# Altium project plc_module_xs.00001.001.PrjPcb
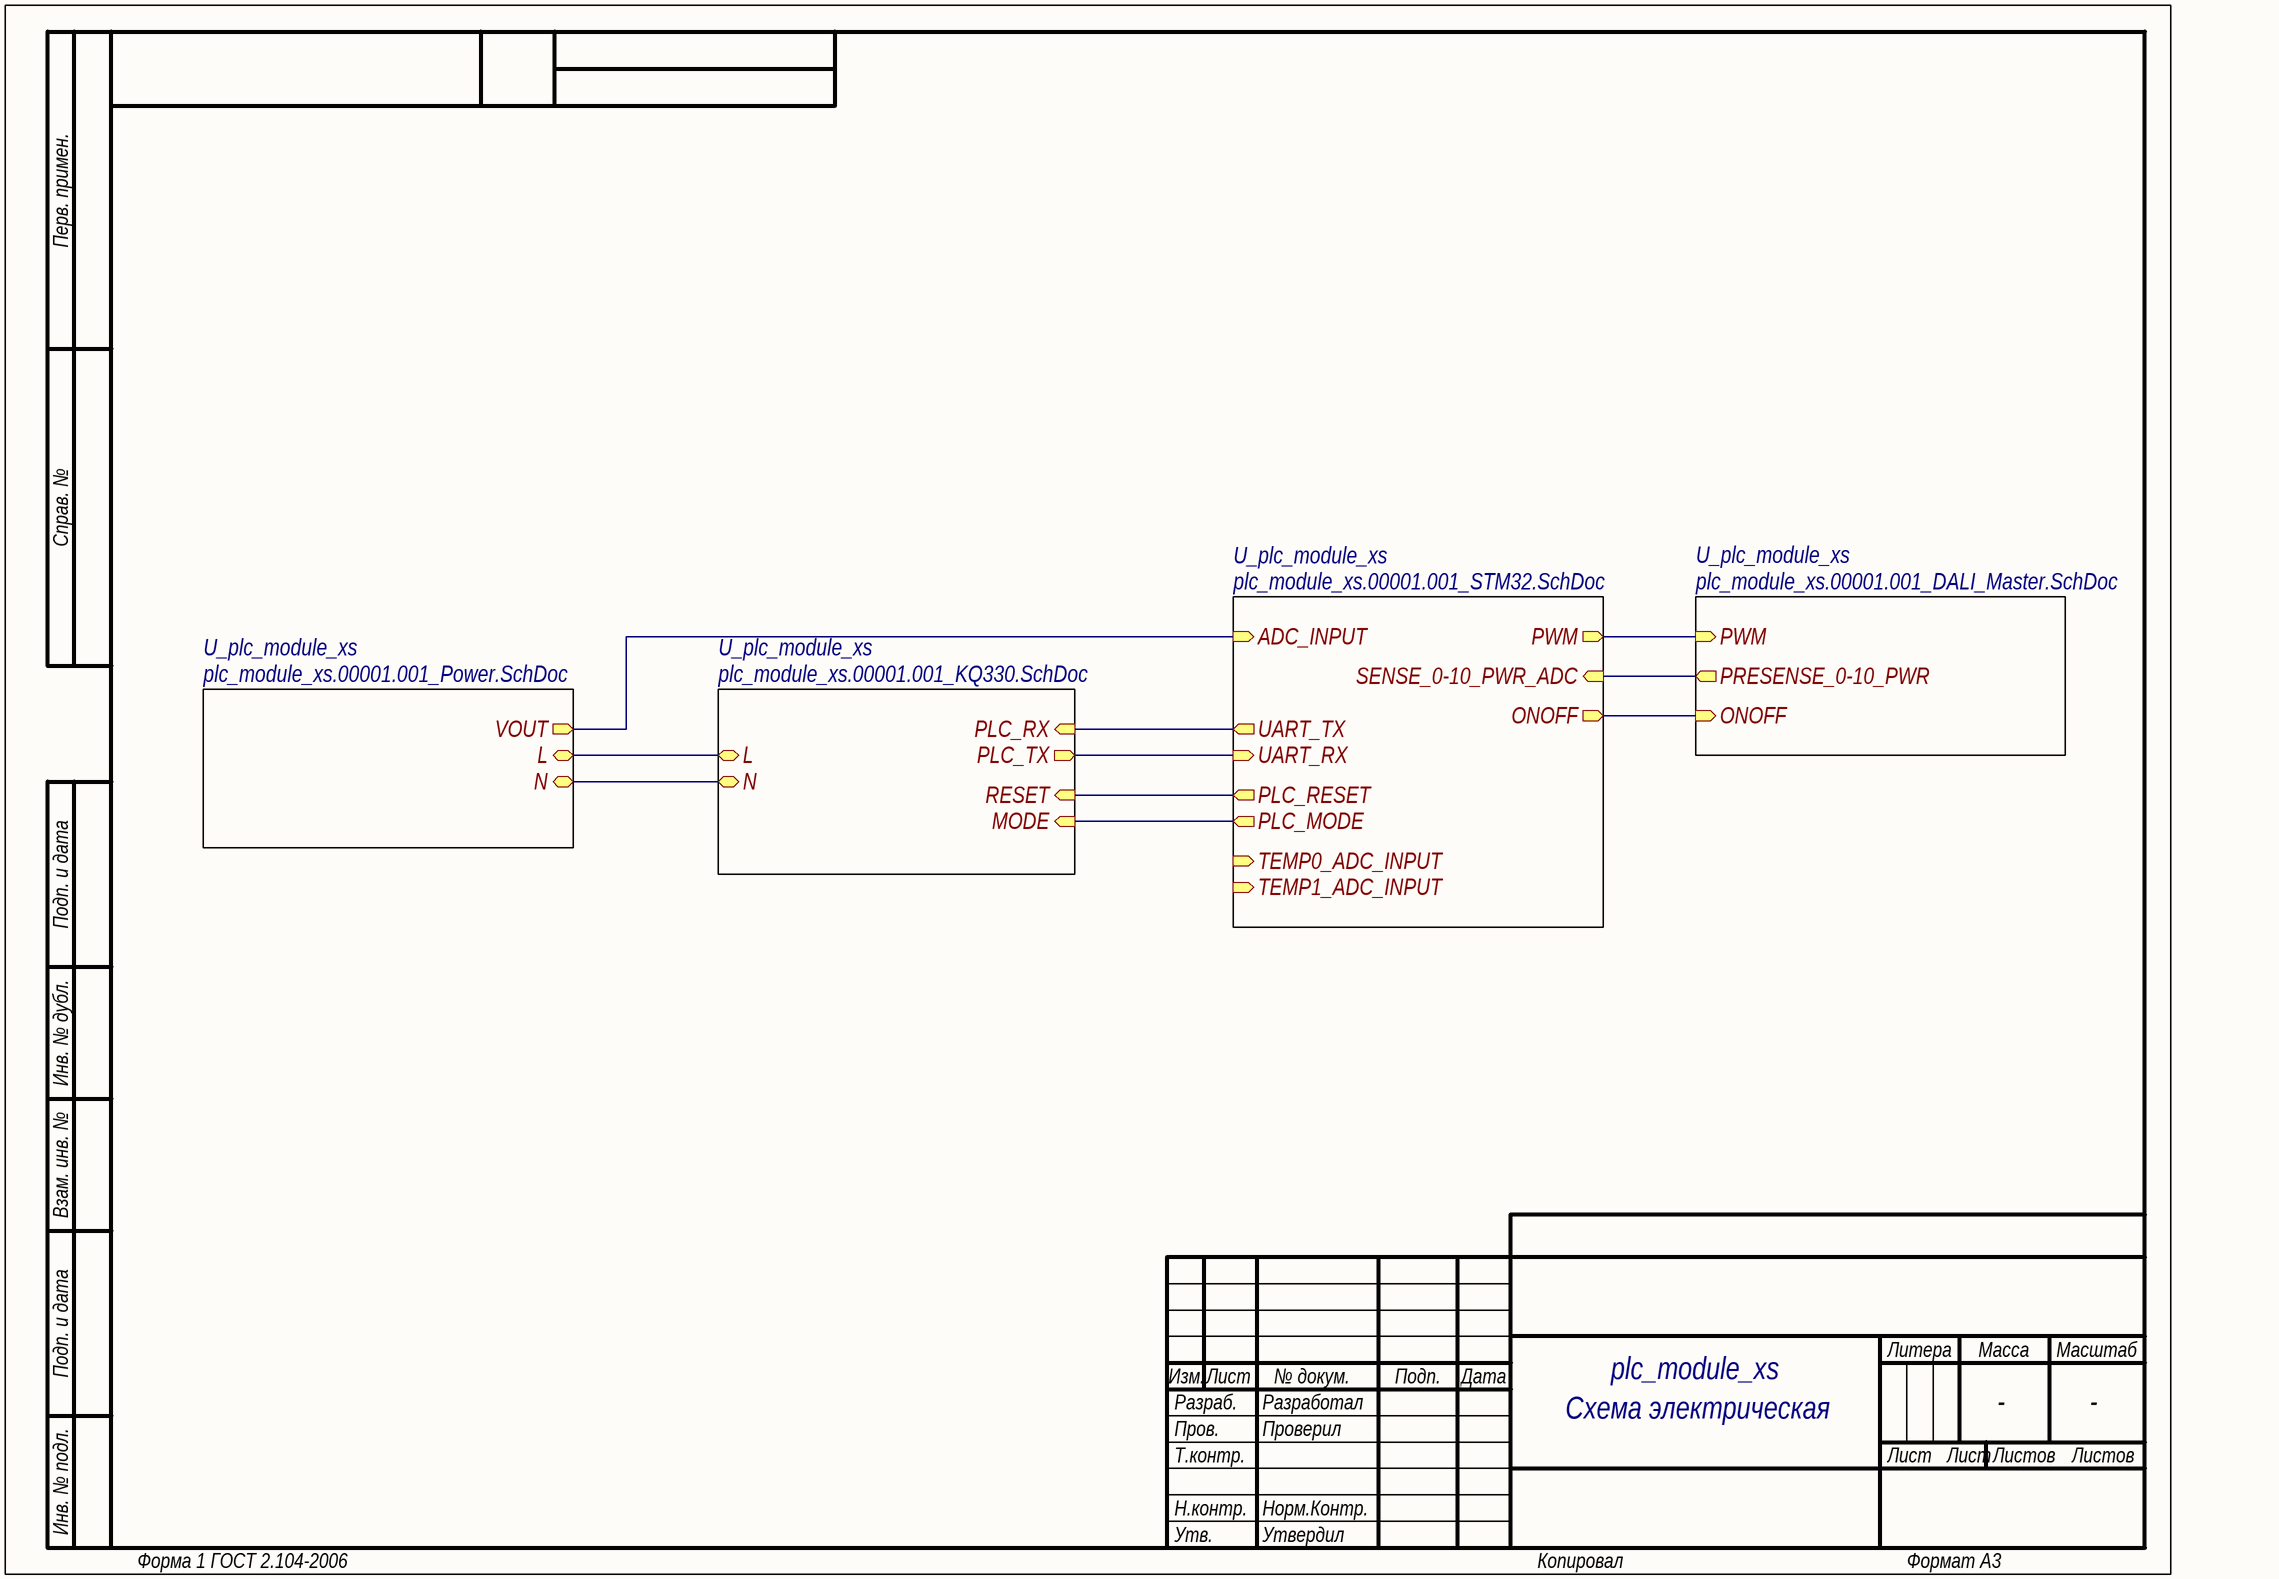
[diagram p0: plc_module_xs.00001.001_Top.SchDoc]
GlobalOrganizationName: TheGreenLight; GlobalProjectName: plc_module_xs; GlobalProjectNumber: 000001.001; GlobalProjectRevision: 1.0
5 sheets, 82 parts. Net scope: hierarchical (ports join the sheet entries above them; power ports are global).
Board file: plc_module_xs.00001.001.PcbDoc
Sheets:
  plc_module_xs.00001.001_Top.SchDoc
    U_plc_module_xs = plc_module_xs.00001.001_STM32.SchDoc
    U_plc_module_xs = plc_module_xs.00001.001_DALI_Master.SchDoc
    U_plc_module_xs = plc_module_xs.00001.001_KQ330.SchDoc
    U_plc_module_xs = plc_module_xs.00001.001_Power.SchDoc

## Sheet plc_module_xs.00001.001_Top.SchDoc: =GlobalProjectName
size 410 x 297 mm; ApprovedBy: Утвердил; CheckedBy: Проверил; Author: Разработал; Organization: TheGreenLight; DocumentNumber: 000001.001 Э3; Revision: 1.0; SheetNumber: Лист; SheetTotal: Листов; PageSetup: Record=PageOptions|CenterHorizontal=True|CenterVertical=True|PrintScale=1.00|XCorrection=1.00|YCorrection=1.00|PrintKind=1|BorderSize=5000000|LeftOffset=0|BottomOffset=0|Orientation=2|PaperLength=1000|PaperWidth=1000|Scale=100|PaperSource=15|PrintQuality=1200|MediaType=1|DitherType=10|PaperKind=A3|PrintScaleMode=1; Weight: -; ScaleFactor: -; NormInspection: Норм.Контр.; FirstApplication: 000001.001; DocumentName: plc_module_xs

### Sub-sheets
U_plc_module_xs = plc_module_xs.00001.001_STM32.SchDoc: UART_TX (out), UART_RX (in), PLC_MODE (out), PLC_RESET (out), PWM (out), ADC_INPUT (in), SENSE_0-10_PWR_ADC (in), TEMP0_ADC_INPUT (in), TEMP1_ADC_INPUT (in), ONOFF (out)
U_plc_module_xs = plc_module_xs.00001.001_DALI_Master.SchDoc: PWM (in), PRESENSE_0-10_PWR (out), ONOFF (in)
U_plc_module_xs = plc_module_xs.00001.001_KQ330.SchDoc: MODE (in), N, RESET (in), L, PLC_RX (in), PLC_TX (out)
U_plc_module_xs = plc_module_xs.00001.001_Power.SchDoc: L, N, VOUT (out)

### Nets
NetC10_2: sheet U_plc_module_xs/L, sheet U_plc_module_xs/L
NetDA1_7: sheet U_plc_module_xs/SENSE_0-10_PWR_ADC, sheet U_plc_module_xs/PRESENSE_0-10_PWR
NetDA2_2: sheet U_plc_module_xs/N, sheet U_plc_module_xs/N
NetDD1_6: sheet U_plc_module_xs/UART_TX, sheet U_plc_module_xs/PLC_RX
NetDD1_9: sheet U_plc_module_xs/UART_RX, sheet U_plc_module_xs/PLC_TX
NetDD1_10: sheet U_plc_module_xs/PLC_MODE, sheet U_plc_module_xs/MODE
NetDD1_11: sheet U_plc_module_xs/PLC_RESET, sheet U_plc_module_xs/RESET
NetDD2_7: sheet U_plc_module_xs/ADC_INPUT, sheet U_plc_module_xs/VOUT
NetDD8_9: sheet U_plc_module_xs/PWM, sheet U_plc_module_xs/PWM
NetDD8_14: sheet U_plc_module_xs/ONOFF, sheet U_plc_module_xs/ONOFF

### Notes on the sheet
- Схема электрическая
  принципиальная
- Перв. примен.
- Справ. №
- Подп. и дата
- Инв. № дубл.
- Взам. инв. №
- Разраб.
- Изм.
- Лист
- № докум.
- Подп.
- Дата
- Литера
- Масса
- Масштаб
- Пров.
- Т.контр.
- Листов
- Инв. № подл.
- Н.контр.
- Утв.
- Форма 1 ГОСТ 2.104-2006
- Копировал
- Формат А3

## Sheet plc_module_xs.00001.001_STM32.SchDoc: =GlobalProjectName
size 410 x 297 mm; ApprovedBy: Утвердил; CheckedBy: Проверил; Author: Разработал; Organization: TheGreenLight; DocumentNumber: 000001.001 Э3; Revision: 1.0; SheetNumber: Лист; SheetTotal: Листов; PageSetup: Record=PageOptions|CenterHorizontal=True|CenterVertical=True|PrintScale=1.00|XCorrection=1.00|YCorrection=1.00|PrintKind=1|BorderSize=5000000|LeftOffset=0|BottomOffset=0|Orientation=2|PaperLength=1000|PaperWidth=1000|Scale=100|PaperSource=15|PrintQuality=1200|MediaType=1|DitherType=10|PaperKind=A3|PrintScaleMode=1; Weight: -; ScaleFactor: -; NormInspection: Норм.Контр.; FirstApplication: 000001.001; DocumentName: plc_module_xs
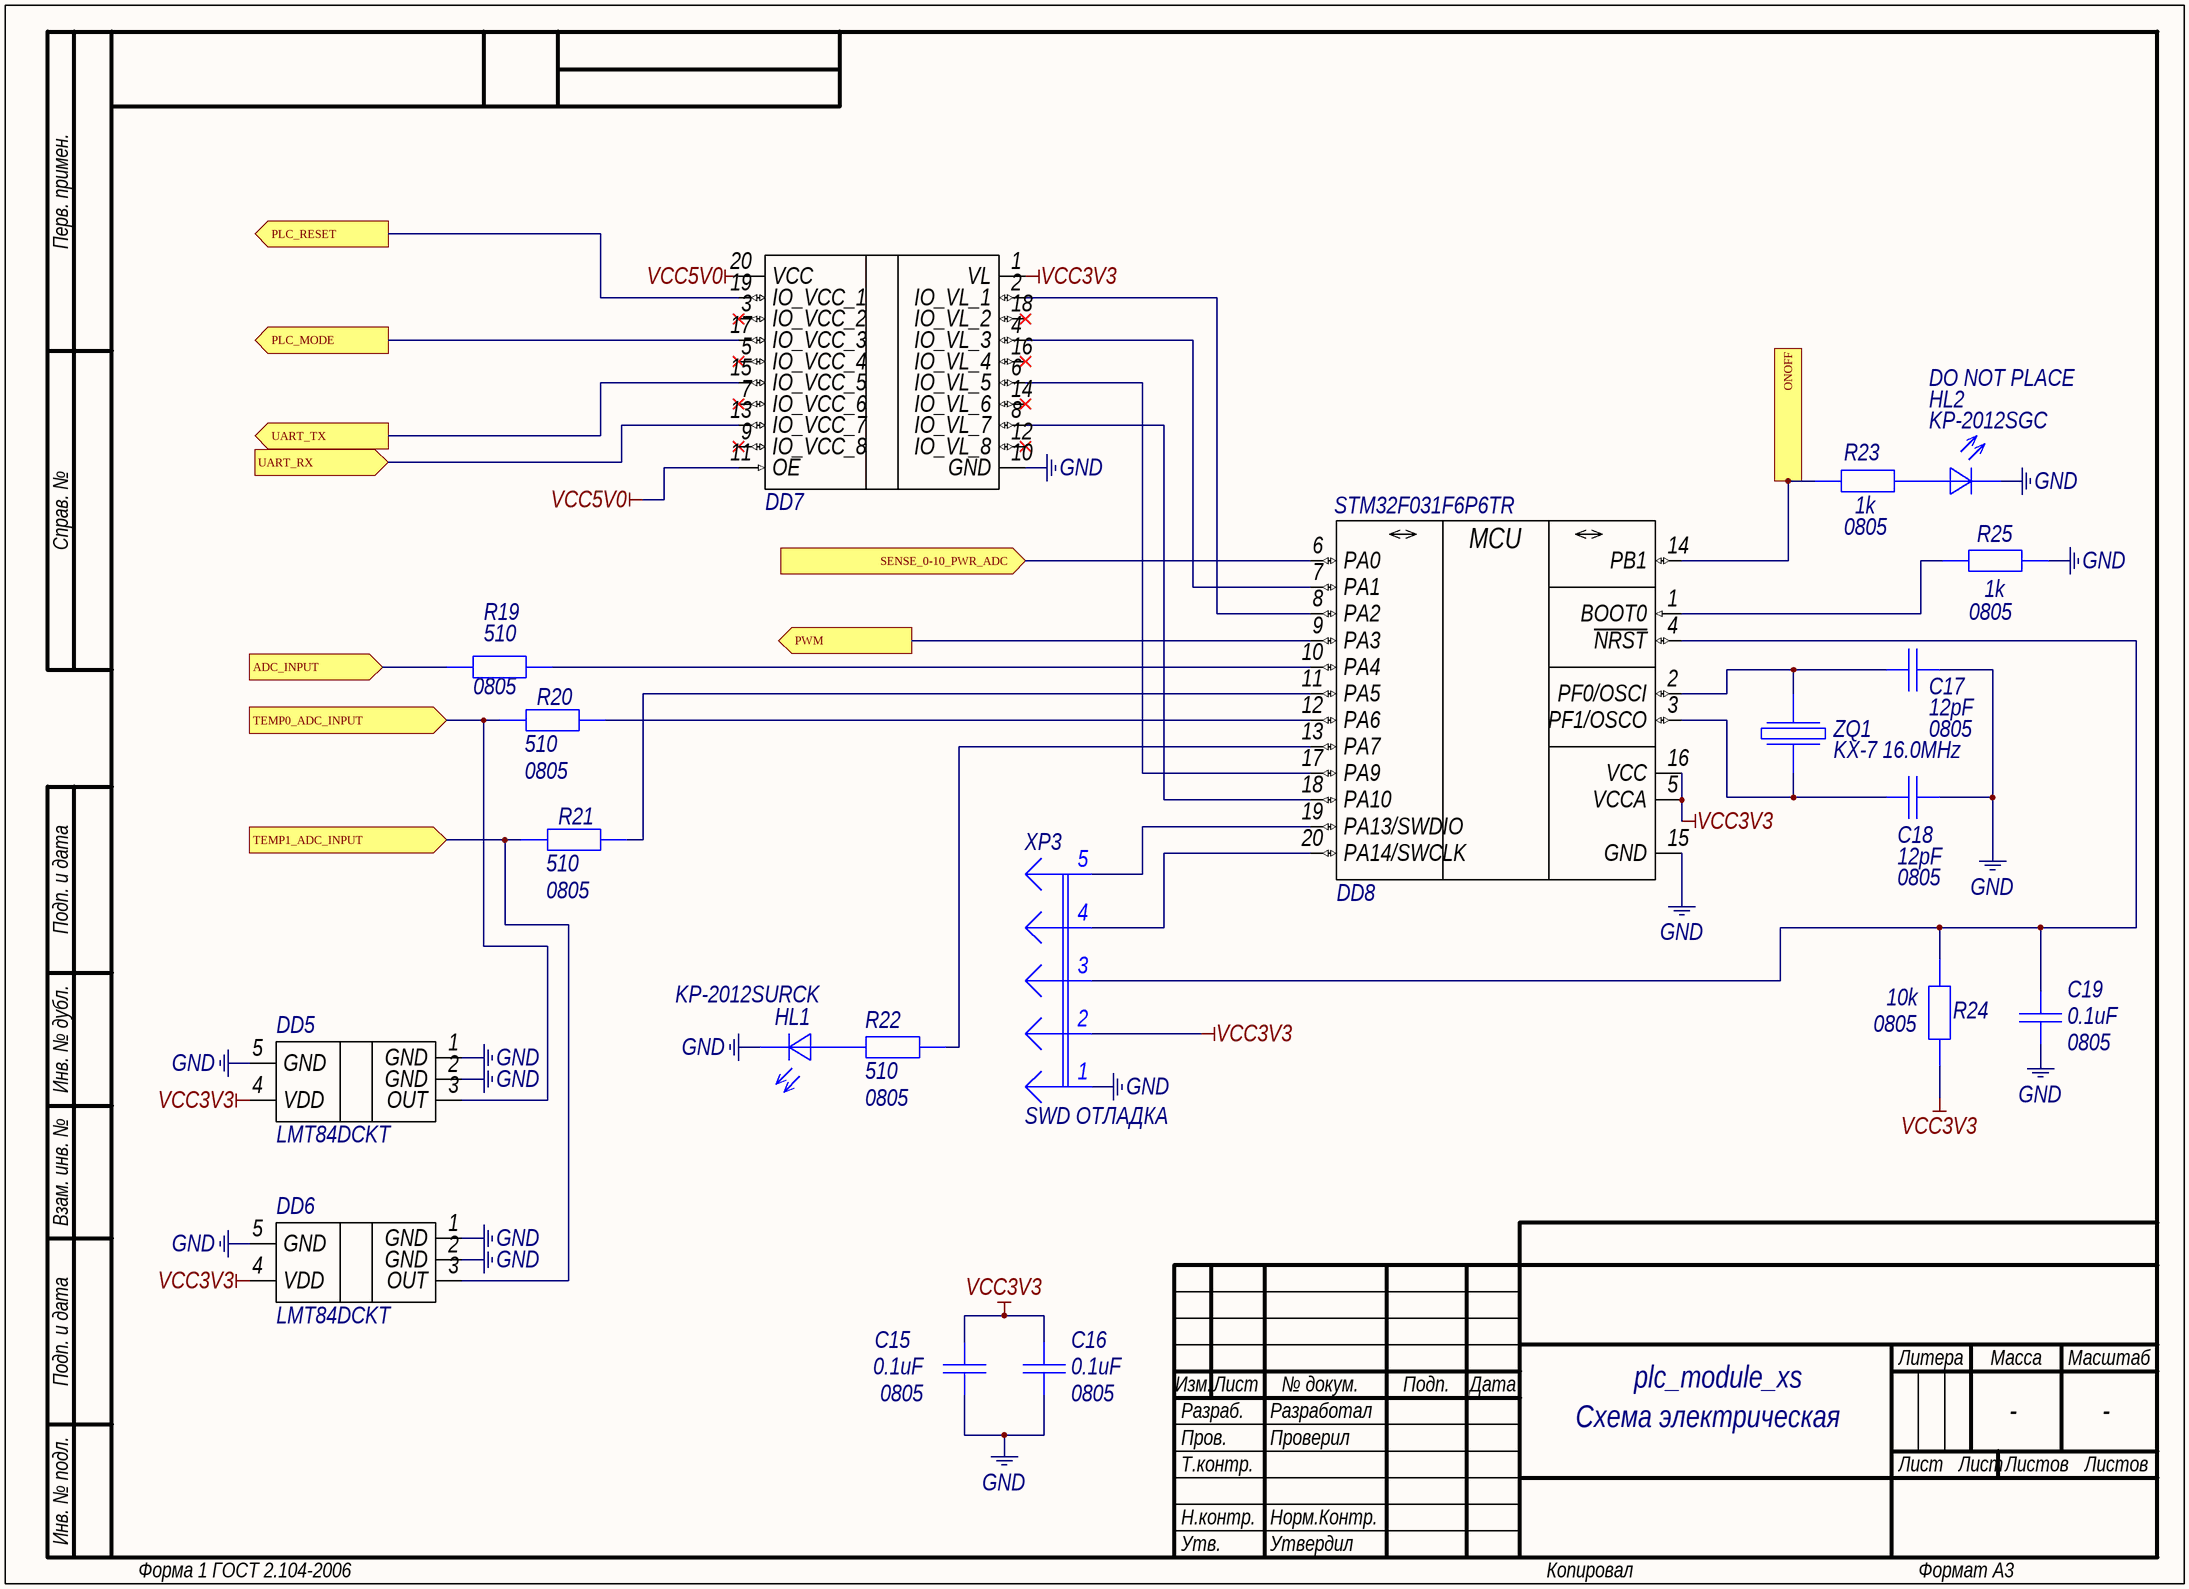
[diagram p1: plc_module_xs.00001.001_STM32.SchDoc]

### Parts
C15  Footprint: 0805  [C0805]  (hidden comment: 0.1uF)
C16  Footprint: 0805  [C0805]  (hidden comment: 0.1uF)
C17  12pF  Footprint: 0805  [C0805]
C18  12pF  Footprint: 0805  [C0805]
C19  Footprint: 0805  [C0805]  (hidden comment: 0.1uF)
DD5  LMT84DCKT  [SOT65P210X110-5N]
DD6  LMT84DCKT  [SOT65P210X110-5N]
DD7  ST2378ETTR  [SOP65P640X120-20N]  (value not drawn)
DD8  STM32F031F6P6TR  [STM-TSSOP20_N]
HL1  KP-2012SURCK  [LD0805]
HL2  DO NOT PLACE  Part Number: KP-2012SGC  [LD0805]
R19  Footprint: 0805  [R0805]  (hidden comment: 510)
R20  Footprint: 0805  [R0805]  (hidden comment: 510)
R21  Footprint: 0805  [R0805]  (hidden comment: 510)
R22  Footprint: 0805  [R0805]  (hidden comment: 510)
R23  Footprint: 0805  [R0805]  (hidden comment: 1k)
R24  Footprint: 0805  [R0805]  (hidden comment: 10k)
R25  Footprint: 0805  [R0805]  (hidden comment: 1k)
XP3  SWD ОТЛАДКА  [PLS-5]
ZQ1  value KX-7 16.0MHz  [SMD 3.2x2.5mm]  (hidden comment: Crystal-1_3p)

### Ports
ADC_INPUT (in), ONOFF (out), PLC_MODE (out), PLC_RESET (out), PWM (out), SENSE_0-10_PWR_ADC (in), TEMP0_ADC_INPUT (in), TEMP1_ADC_INPUT (in), UART_RX (in), UART_TX (out)

### Nets
GND: C15.2 C16.1 C17.1 C18.1 C19.1 DD5.1(GND) DD5.2(GND) DD5.5(GND) DD6.1(GND) DD6.2(GND) DD6.5(GND) DD7.10(GND) DD8.15(GND) HL1.2(К) HL2.2(К) R25.2 XP3.1
VCC3V3: C15.1 C16.2 DD5.4(VDD) DD6.4(VDD) DD7.1(VL) DD8.5(VCCA) DD8.16(VCC) R24.1 XP3.2
VCC5V0: DD7.11(OE) DD7.20(VCC)
NetC17_2: C17.2 DD8.2(PF0/OSCI) ZQ1.3
NetC18_2: C18.2 DD8.3(PF1/OSCO) ZQ1.1
NetC19_2: C19.2 DD8.4(~{NRST}) R24.2 XP3.3
NetDA1_7: DD8.6(PA0) ; port SENSE_0-10_PWR_ADC
NetDD1_6: DD7.15(IO_VCC_5) ; port UART_TX
NetDD1_9: DD7.13(IO_VCC_7) ; port UART_RX
NetDD1_10: DD7.17(IO_VCC_3) ; port PLC_MODE
NetDD1_11: DD7.19(IO_VCC_1) ; port PLC_RESET
NetDD2_7: R19.2 ; port ADC_INPUT
NetDD5_3: DD5.3(OUT) R20.2 ; port TEMP0_ADC_INPUT
NetDD6_3: DD6.3(OUT) R21.2 ; port TEMP1_ADC_INPUT
NetDD7_2: DD7.2(IO_VL_1) DD8.8(PA2)
NetDD7_4: DD7.4(IO_VL_3) DD8.7(PA1)
NetDD7_6: DD7.6(IO_VL_5) DD8.17(PA9)
NetDD7_8: DD7.8(IO_VL_7) DD8.18(PA10)
NetDD8_1: DD8.1(BOOT0) R25.1
NetDD8_9: DD8.9(PA3) ; port PWM
NetDD8_10: DD8.10(PA4) R19.1
NetDD8_11: DD8.11(PA5) R21.1
NetDD8_12: DD8.12(PA6) R20.1
NetDD8_13: DD8.13(PA7) R22.1
NetDD8_14: DD8.14(PB1) R23.1 ; port ONOFF
NetDD8_19: DD8.19(PA13/SWDIO) XP3.5
NetDD8_20: DD8.20(PA14/SWCLK) XP3.4
NetHL1_1: HL1.1(А) R22.2
NetHL2_1: HL2.1(А) R23.2

Not connected (* = marked no-connect by the designer): DD7 3(IO_VCC_2)* 5(IO_VCC_4)* 7(IO_VCC_6)* 9(IO_VCC_8)* 12(IO_VL_8)* 14(IO_VL_6)* 16(IO_VL_4)* 18(IO_VL_2)*

### Notes on the sheet
- Схема электрическая
  принципиальная
- Перв. примен.
- Справ. №
- Подп. и дата
- Инв. № дубл.
- Взам. инв. №
- Разраб.
- Изм.
- Лист
- № докум.
- Подп.
- Дата
- Литера
- Масса
- Масштаб
- Пров.
- Т.контр.
- Листов
- Инв. № подл.
- Н.контр.
- Утв.
- Форма 1 ГОСТ 2.104-2006
- Копировал
- Формат А3
- (in symbol STM32F031F6P6TR) MCU

### Library data of the parts
C15 C16 C19 = GRM21BR71H104KA01L: Manufacturer: Murata; Type: Конденсатор; ID: 138; Voltage: 50V; Tolerance: ±10%; Dielectric Type: X7R; Application Category: 1; Working Temperature Min: -55°С; Working Temperature Max: +125°С; Published: 18.05.2010; Publisher: Andrew Danich; Part Number: GRM21BR71H104KA01L; Value: 0.1uF
C17 C18 = CC0805JRNPO9BN120: Manufacturer: Yageo; Type: Конденсатор; ID: 239; Voltage: 50V; Tolerance: ±5%; Dielectric Type: NP0; Application Category: 1; Working Temperature Min: -55°С; Working Temperature Max: +125°С; Published: 18.05.2010; Publisher: Andrew Danich; Part Number: CC0805JRNPO9BN120; Value: 12pF; Distributor1: Terraelectronica
DD5 DD6 = LMT84DCKT: LMT84/LMT84-Q1 1.5V, SC70/TO-92/TO-126,Analog Temperature Sensors with Class-AB Output; Manufacturer: Texas Instruments; ID: 9; URL1: <div><a href="https://www.terraelectronica.ru/product/1196420">https://www.terraelectronica.ru/product/1196420</a></div>; Part Number: LMT84DCKT; Value: LMT84DCKT; Distributor1: terraelectronica
DD7 = ST2378ETTR: 8-bit dual supply 1.71 V to 5.5 V level translator with I/O VCC ±15 kV ESD protection; Manufacturer: STMicroelectronics; ID: 8; Input Voltage: 1.7V to 5.5V; URL1: <div><a href="https://www.terraelectronica.ru/product/448973">https://www.terraelectronica.ru/product/448973</a></div>; Published: 18.08.2014; Publisher: Andrew Danich; Type: Микросхема; Part Number: ST2378ETTR; Value: ST2378ETTR; Distributor1: terraelectronica
DD8 = STM32F031F6P6TR: Manufacturer: STMicroelectronics; ID: 29; Supply Operation: +2.4…3.6V; Flash: 32K; SRAM: 4K; Prog Interface: SWD; I/O Lines: 15; Operation Frequency: 48MHz; Application Category: 1; Working Temperature Min: -40°С; Working Temperature Max: +85°С; Published: 27.07.2015; Publisher: Andrew Danich; Type: Микросхема; Part Number: STM32F031F6P6TR; Value: STM32F031F6P6TR; EEPROM: -; Distributor1: Terraelectronica; Distributor2: ChipDip; URL1: https://www.terraelectronica.ru/product/2176678
HL1 = KP-2012SURCK: Manufacturer: Kingbright; Type: Индикатор единичный; ID: 23; Forward Voltage: 2.5V; Forward Current: 30mA; Power Dissipation: 75mW; Luminous Flux: 150; Color: Red; Leds: 1; Working Temperature Min: -40°С; Working Temperature Max: +85°С; Published: 03.12.2013; Publisher: Andrew Danich; Part Number: KP-2012SURCK; Value: KP-2012SURCK; Footprint: 0805; Application Category: 1
HL2 = KP-2012SGC: Manufacturer: Kingbright; Type: Индикатор единичный; ID: 21; Forward Voltage: 2.5V; Forward Current: 25mA; Power Dissipation: 62.5mW; Color: Green; Leds: 1; Working Temperature Min: -40°С; Working Temperature Max: +85°С; Published: 03.12.2013; Publisher: Andrew Danich; Value: KP-2012SGC; Footprint: 0805; Application Category: 1
R19-R22 = RC0805JR-07510RL: Manufacturer: Yageo; ID: 153; Limit Voltage: 150V; Tolerance: ±5%; Temperature Coefficient: 100ppm; Total Power Dissipation: 0.125W; Series Type: Thick-Film; Application Category: 1; Working Temperature Min: -55°С; Working Temperature Max: +155°С; Published: 24.03.2010; Publisher: Andrew Danich; Type: Резистор; Part Number: RC0805JR-07510RL; Value: 510
R23 R25 = RC0805JR-071KL: Manufacturer: Yageo; ID: 112; Limit Voltage: 150V; Tolerance: ±5%; Temperature Coefficient: 100ppm; Total Power Dissipation: 0.125W; Series Type: Thick-Film; Application Category: 1; Working Temperature Min: -55°С; Working Temperature Max: +155°С; Published: 24.03.2010; Publisher: Andrew Danich; Type: Резистор; Part Number: RC0805JR-071KL; Value: 1k
R24 = RC0805JR-0710KL: Manufacturer: Yageo; ID: 99; Limit Voltage: 150V; Tolerance: ±5%; Temperature Coefficient: 100ppm; Total Power Dissipation: 0.125W; Series Type: Thick-Film; Application Category: 1; Working Temperature Min: -55°С; Working Temperature Max: +155°С; Published: 24.03.2010; Publisher: Andrew Danich; Type: Резистор; Part Number: RC0805JR-0710KL; Value: 10k
XP3 = PLS-5: Value: PLS-5; ID: 4; Limit Voltage: 250V; Limit Current: 3A; Connector Type: Male; Resistance: 15momh; Surface Finish: Gold; Pitch: 2.54mm; Published: 07.03.2013; Publisher: Andrew Danich; Type: Вилка; Part Number: PLS-5; Pins: 5
ZQ1 = KX-7 16.0MHz: Manufacturer: GEYER ELECTRONIC; ID: 27; Output Frequency: 16МГц; Load Capacitance: 10pF; Temperature Coefficient: ±30ppm; Application Category: 1; Working Temperature Min: -20°С; Working Temperature Max: +70°С; URL1: <div><a href="https://www.terraelectronica.ru/product/165772">https://www.terraelectronica.ru/product/165772</a></div>; Published: 12.09.2014; Publisher: Andrew Danich; Type: Резонатор; Part Number: KX-7 16.0MHz; Functional Analog: -; Distributor1: terraelectronica

## Sheet plc_module_xs.00001.001_DALI_Master.SchDoc: =GlobalProjectName
size 410 x 297 mm; ApprovedBy: Утвердил; CheckedBy: Проверил; Author: Разработал; Organization: TheGreenLight; DocumentNumber: 000001.001 Э3; Revision: 1.0; SheetNumber: Лист; SheetTotal: Листов; PageSetup: Record=PageOptions|CenterHorizontal=True|CenterVertical=True|PrintScale=1.00|XCorrection=1.00|YCorrection=1.00|PrintKind=1|BorderSize=5000000|LeftOffset=0|BottomOffset=0|Orientation=2|PaperLength=1000|PaperWidth=1000|Scale=100|PaperSource=15|PrintQuality=1200|MediaType=1|DitherType=10|PaperKind=A3|PrintScaleMode=1; Weight: -; ScaleFactor: -; NormInspection: Норм.Контр.; FirstApplication: 000001.001; DocumentName: plc_module_xs
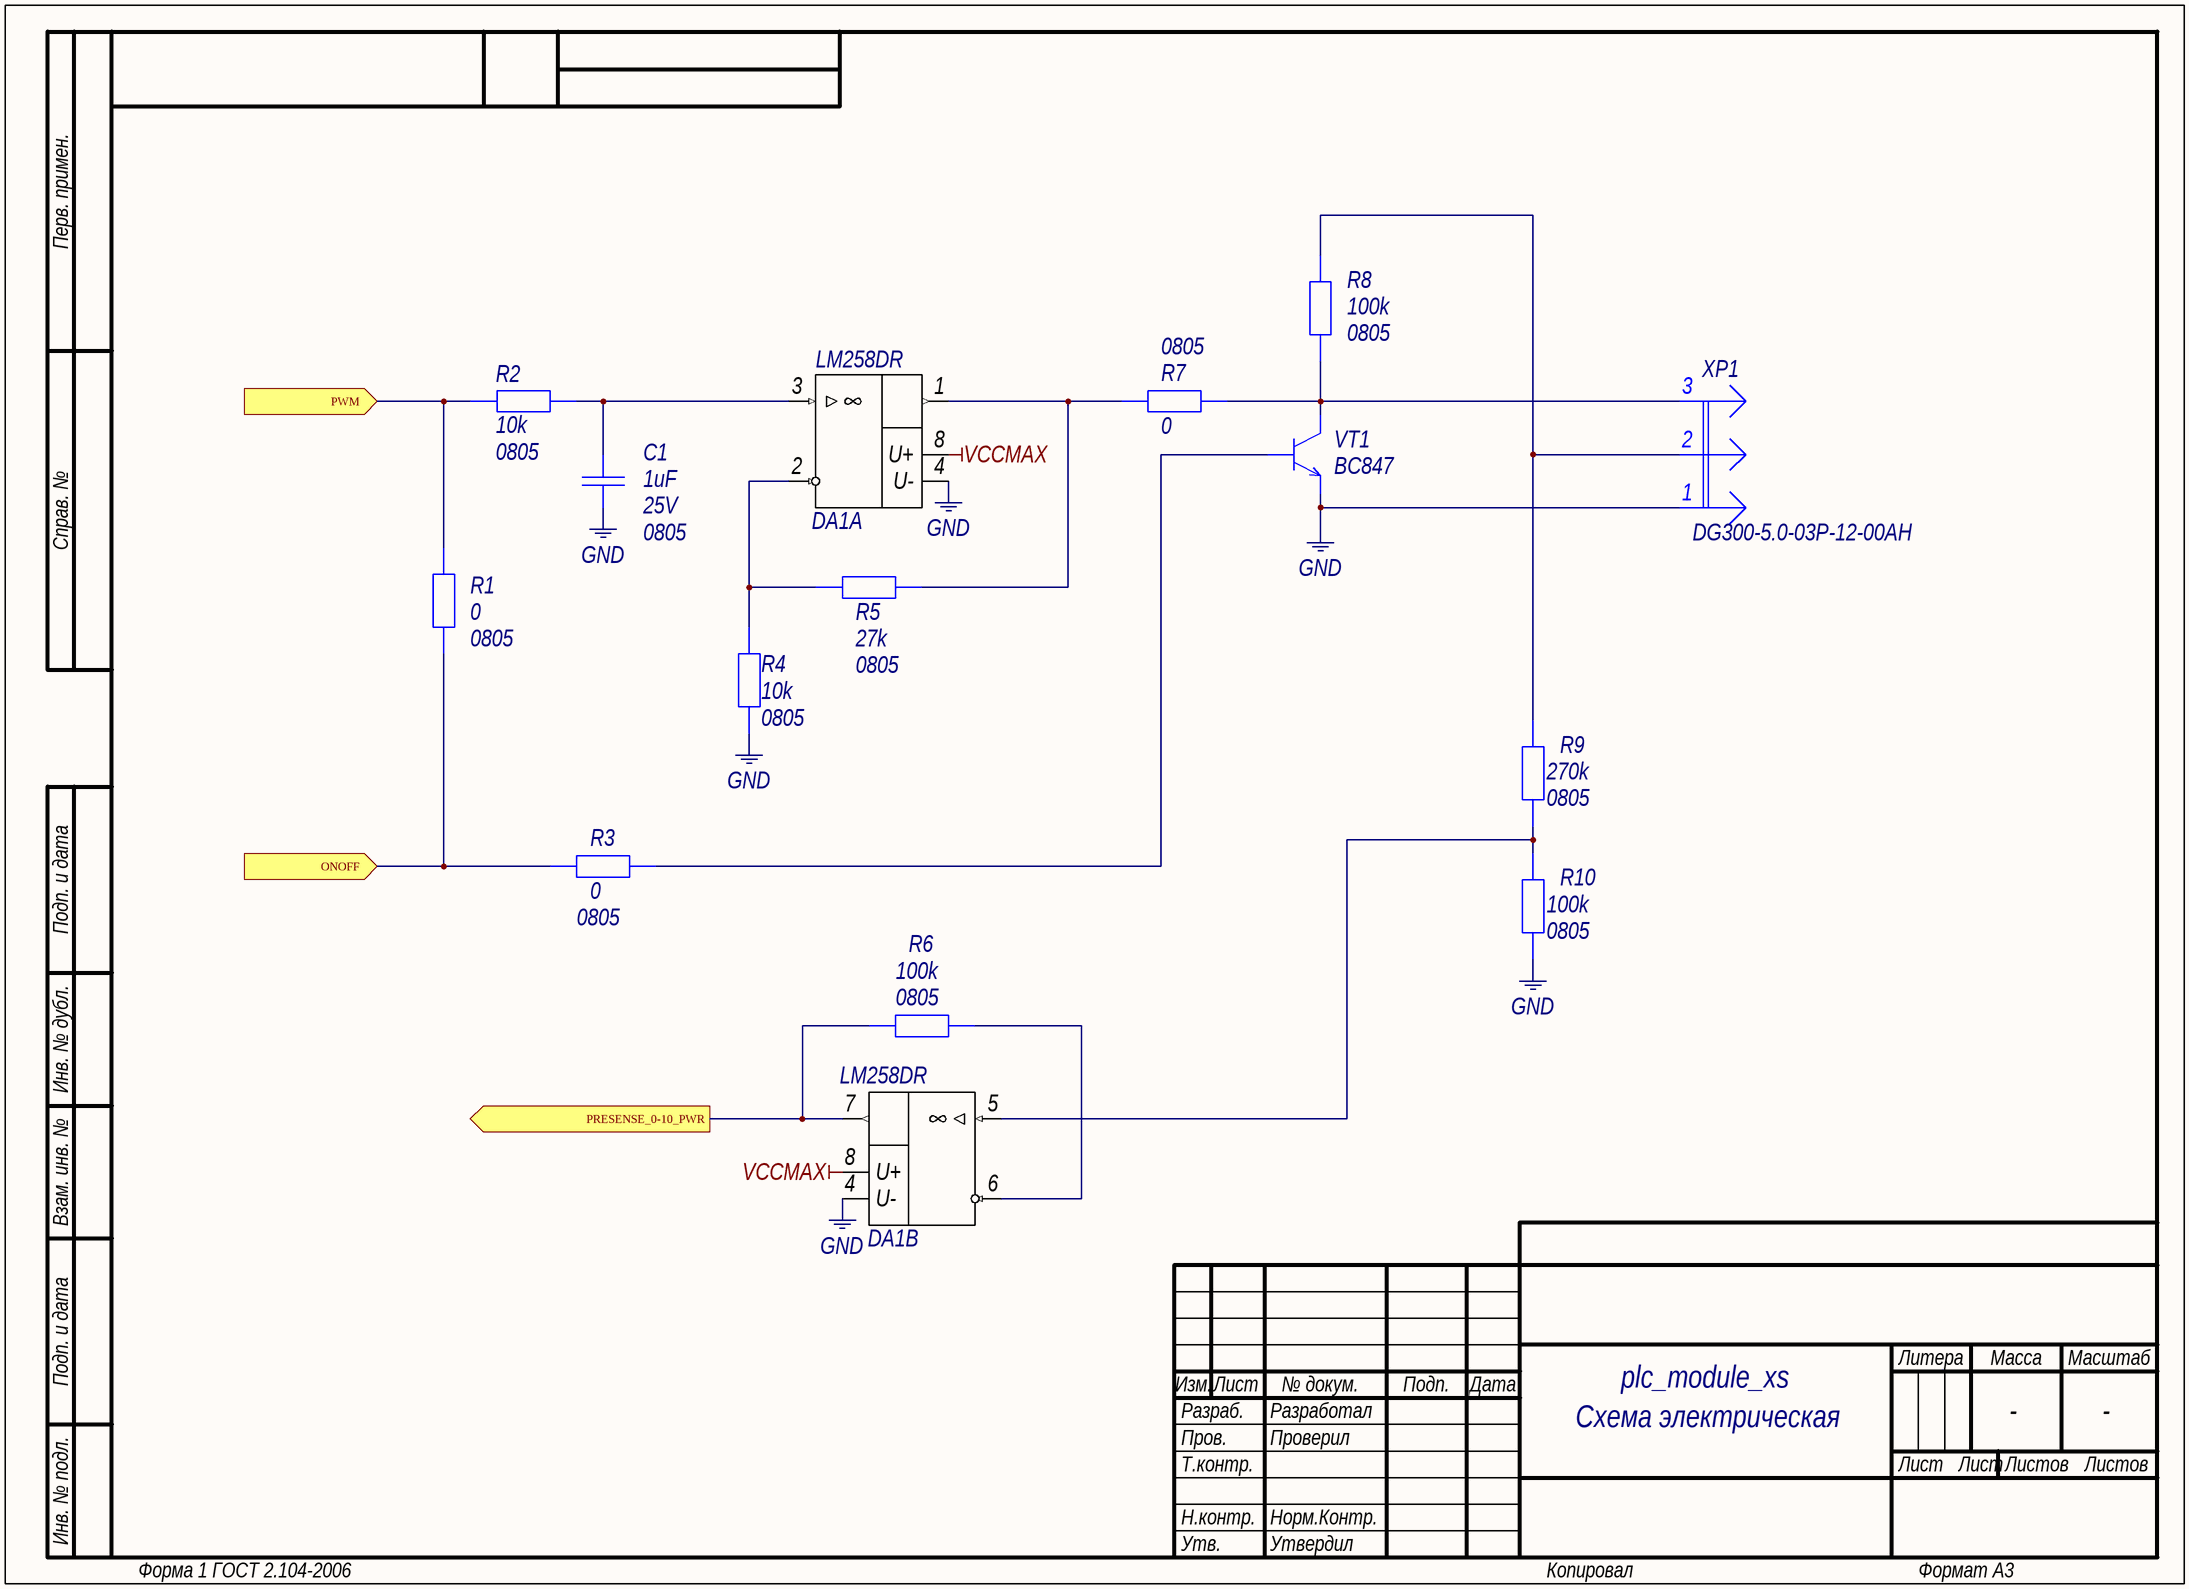
[diagram p2: plc_module_xs.00001.001_DALI_Master.SchDoc]

### Parts
C1  Voltage: 25V  Footprint: 0805  [C0805]  (hidden comment: 1uF)
DA1  LM258DR  [SOIC-8]  (parts A,B of 2)
R1  value 0  Footprint: 0805  [R0805]  (hidden comment: Resistor)
R2  Footprint: 0805  [R0805]  (hidden comment: 10k)
R3  value 0  Footprint: 0805  [R0805]  (hidden comment: Resistor)
R4  Footprint: 0805  [R0805]  (hidden comment: 10k)
R5  Footprint: 0805  [R0805]  (hidden comment: 27k)
R6  Footprint: 0805  [R0805]  (hidden comment: 100k)
R7  Footprint: 0805  [R0805]  (hidden comment: 0)
R8  Footprint: 0805  [R0805]  (hidden comment: 100k)
R9  Footprint: 0805  [R0805]  (hidden comment: 270k)
R10  Footprint: 0805  [R0805]  (hidden comment: 100k)
VT1  value BC847  [SOT-23]  (hidden comment: BJT-NPN)
XP1  value DG300-5.0-03P-12-00AH  [PHOENIX_1715734]  (hidden comment: GND PWR CTRL)

### Ports
ONOFF (in), PRESENSE_0-10_PWR (out), PWM (in)

### Nets
GND: C1.1 DA1.4(U-) R4.2 R10.1 VT1.3(Э) XP1.1
VCCMAX: DA1.8(U+)
NetC1_2: C1.2 DA1.3(IN+) R2.1
NetDA1_1: DA1.1(OUT) R5.2 R7.1
NetDA1_2: DA1.2(IN-) R4.1 R5.1
NetDA1_5: DA1.5(IN+) R9.1 R10.2
NetDA1_6: DA1.6(IN-) R6.2
NetDA1_7: DA1.7(OUT) R6.1 ; port PRESENSE_0-10_PWR
NetDD8_9: R1.1 R2.2 ; port PWM
NetDD8_14: R1.2 R3.1 ; port ONOFF
NetR3_2: R3.2 VT1.1(Б)
NetR7_2: R7.2 R8.1 VT1.2(К) XP1.3
NetR8_2: R8.2 R9.2 XP1.2

### Notes on the sheet
- Схема электрическая
  принципиальная
- Перв. примен.
- Справ. №
- Подп. и дата
- Инв. № дубл.
- Взам. инв. №
- Разраб.
- Изм.
- Лист
- № докум.
- Подп.
- Дата
- Литера
- Масса
- Масштаб
- Пров.
- Т.контр.
- Листов
- Инв. № подл.
- Н.контр.
- Утв.
- Форма 1 ГОСТ 2.104-2006
- Копировал
- Формат А3

### Library data of the parts
C1 = GRM219R71E105KA88D: Manufacturer: Murata; Type: Конденсатор; ID: 229; Tolerance: ±10%; Dielectric Type: X7R; Application Category: 1; Working Temperature Min: -55°С; Working Temperature Max: +125°С; Published: 18.05.2010; Publisher: Andrew Danich; Part Number: GRM219R71E105KA88D; Value: 1uF
DA1 = LM258DR: ID: 65; Supply Operation: +3…32V; Supply Current: 1.2mA; Rail-to-Rail: -\-; Slew Rate: 0.3V/µs; Bandwidth: 0.7MHz; Published: 08.12.2013; Publisher: Andrew Danich; Type: Микросхема; Part Number: LM258DR; Value: LM258DR
R1 R3 = RC0805JR-070RL: Manufacturer: Yageo; ID: 421; Limit Voltage: 150V; Tolerance: ±5%; Temperature Coefficient: 100ppm; Total Power Dissipation: 0.125W; Series Type: Thick-Film; Application Category: 1; Working Temperature Min: -55°С; Working Temperature Max: +155°С; Published: 24.03.2010; Publisher: Andrew Danich; Type: Резистор; Part Number: RC0805JR-070RL
R2 R4 = RC0805JR-0710KL: as R24 on sheet plc_module_xs.00001.001_STM32; Published: 24.03.2010; Publisher: Andrew Danich; Type: Резистор; Part Number: RC0805JR-0710KL; Value: 10k
R5 = RC0805JR-0727KL: Manufacturer: Yageo; ID: 127; Limit Voltage: 150V; Tolerance: ±5%; Temperature Coefficient: 100ppm; Total Power Dissipation: 0.125W; Series Type: Thick-Film; Application Category: 1; Working Temperature Min: -55°С; Working Temperature Max: +155°С; Published: 24.03.2010; Publisher: Andrew Danich; Type: Резистор; Part Number: RC0805JR-0727KL; Value: 27k
R6 R8 R10 = RC0805JR-07100KL: Manufacturer: Yageo; ID: 98; Limit Voltage: 150V; Tolerance: ±5%; Temperature Coefficient: 100ppm; Total Power Dissipation: 0.125W; Series Type: Thick-Film; Application Category: 1; Working Temperature Min: -55°С; Working Temperature Max: +155°С; Published: 24.03.2010; Publisher: Andrew Danich; Type: Резистор; Part Number: RC0805JR-07100KL; Value: 100k
R7 = RC0805JR-0727RL: Part Number: RC0805JR-070RL; Manufacturer: Yageo; ID: 125; Limit Voltage: 150V; Tolerance: ±5%; Temperature Coefficient: 100ppm; Total Power Dissipation: 0.125W; Series Type: Thick-Film; Application Category: 1; Working Temperature Min: -55°С; Working Temperature Max: +155°С; Published: 24.03.2010; Publisher: Andrew Danich; Type: Резистор; Value: 0
R9 = RC0805JR-07270KL: Manufacturer: Yageo; ID: 126; Limit Voltage: 150V; Tolerance: ±5%; Temperature Coefficient: 100ppm; Total Power Dissipation: 0.125W; Series Type: Thick-Film; Application Category: 1; Working Temperature Min: -55°С; Working Temperature Max: +155°С; Published: 24.03.2010; Publisher: Andrew Danich; Type: Резистор; Part Number: RC0805JR-07270KL; Value: 270k
VT1 = BC847: Type: Транзистор; ID: 1; C-E Voltage: 45V; Collector Current: 100mA; C-E Saturation Voltage: 0.6V; DC Current Gain: 110…800; Total Power Dissipation: 250mW; Transition Frequency: 100MHz; Published: 07.05.2013; Publisher: Andrew Danich; Part Number: BC847
XP1 = DG300-5.0-03P-12-00AH: ID: 97; Limit Voltage: 300V; Limit Current: 10A; Connector Type: Female; Resistance: 20mohm; Pitch: 5mm; Working Temperature Min: -40°С; Working Temperature Max: +105°С; URL1: <div><a href="https://www.terraelectronica.ru/product/988120">https://www.terraelectronica.ru/product/988120</a></div>; Published: 07.03.2013; Publisher: Andrew Danich; Type: Вилка; Part Number: DG300-5.0-03P-12-00AH; Pins: 3; Distributor1: terraelectronica

## Sheet plc_module_xs.00001.001_KQ330.SchDoc: =GlobalProjectName
size 410 x 297 mm; ApprovedBy: Утвердил; CheckedBy: Проверил; Author: Разработал; Organization: TheGreenLight; DocumentNumber: 000001.001 Э3; Revision: 1.0; SheetNumber: Лист; SheetTotal: Листов; PageSetup: Record=PageOptions|CenterHorizontal=True|CenterVertical=True|PrintScale=1.00|XCorrection=1.00|YCorrection=1.00|PrintKind=1|BorderSize=5000000|LeftOffset=0|BottomOffset=0|Orientation=2|PaperLength=1000|PaperWidth=1000|Scale=100|PaperSource=15|PrintQuality=1200|MediaType=1|DitherType=10|PaperKind=A3|PrintScaleMode=1; Weight: -; ScaleFactor: -; NormInspection: Норм.Контр.; FirstApplication: 000001.001; DocumentName: plc_module_xs
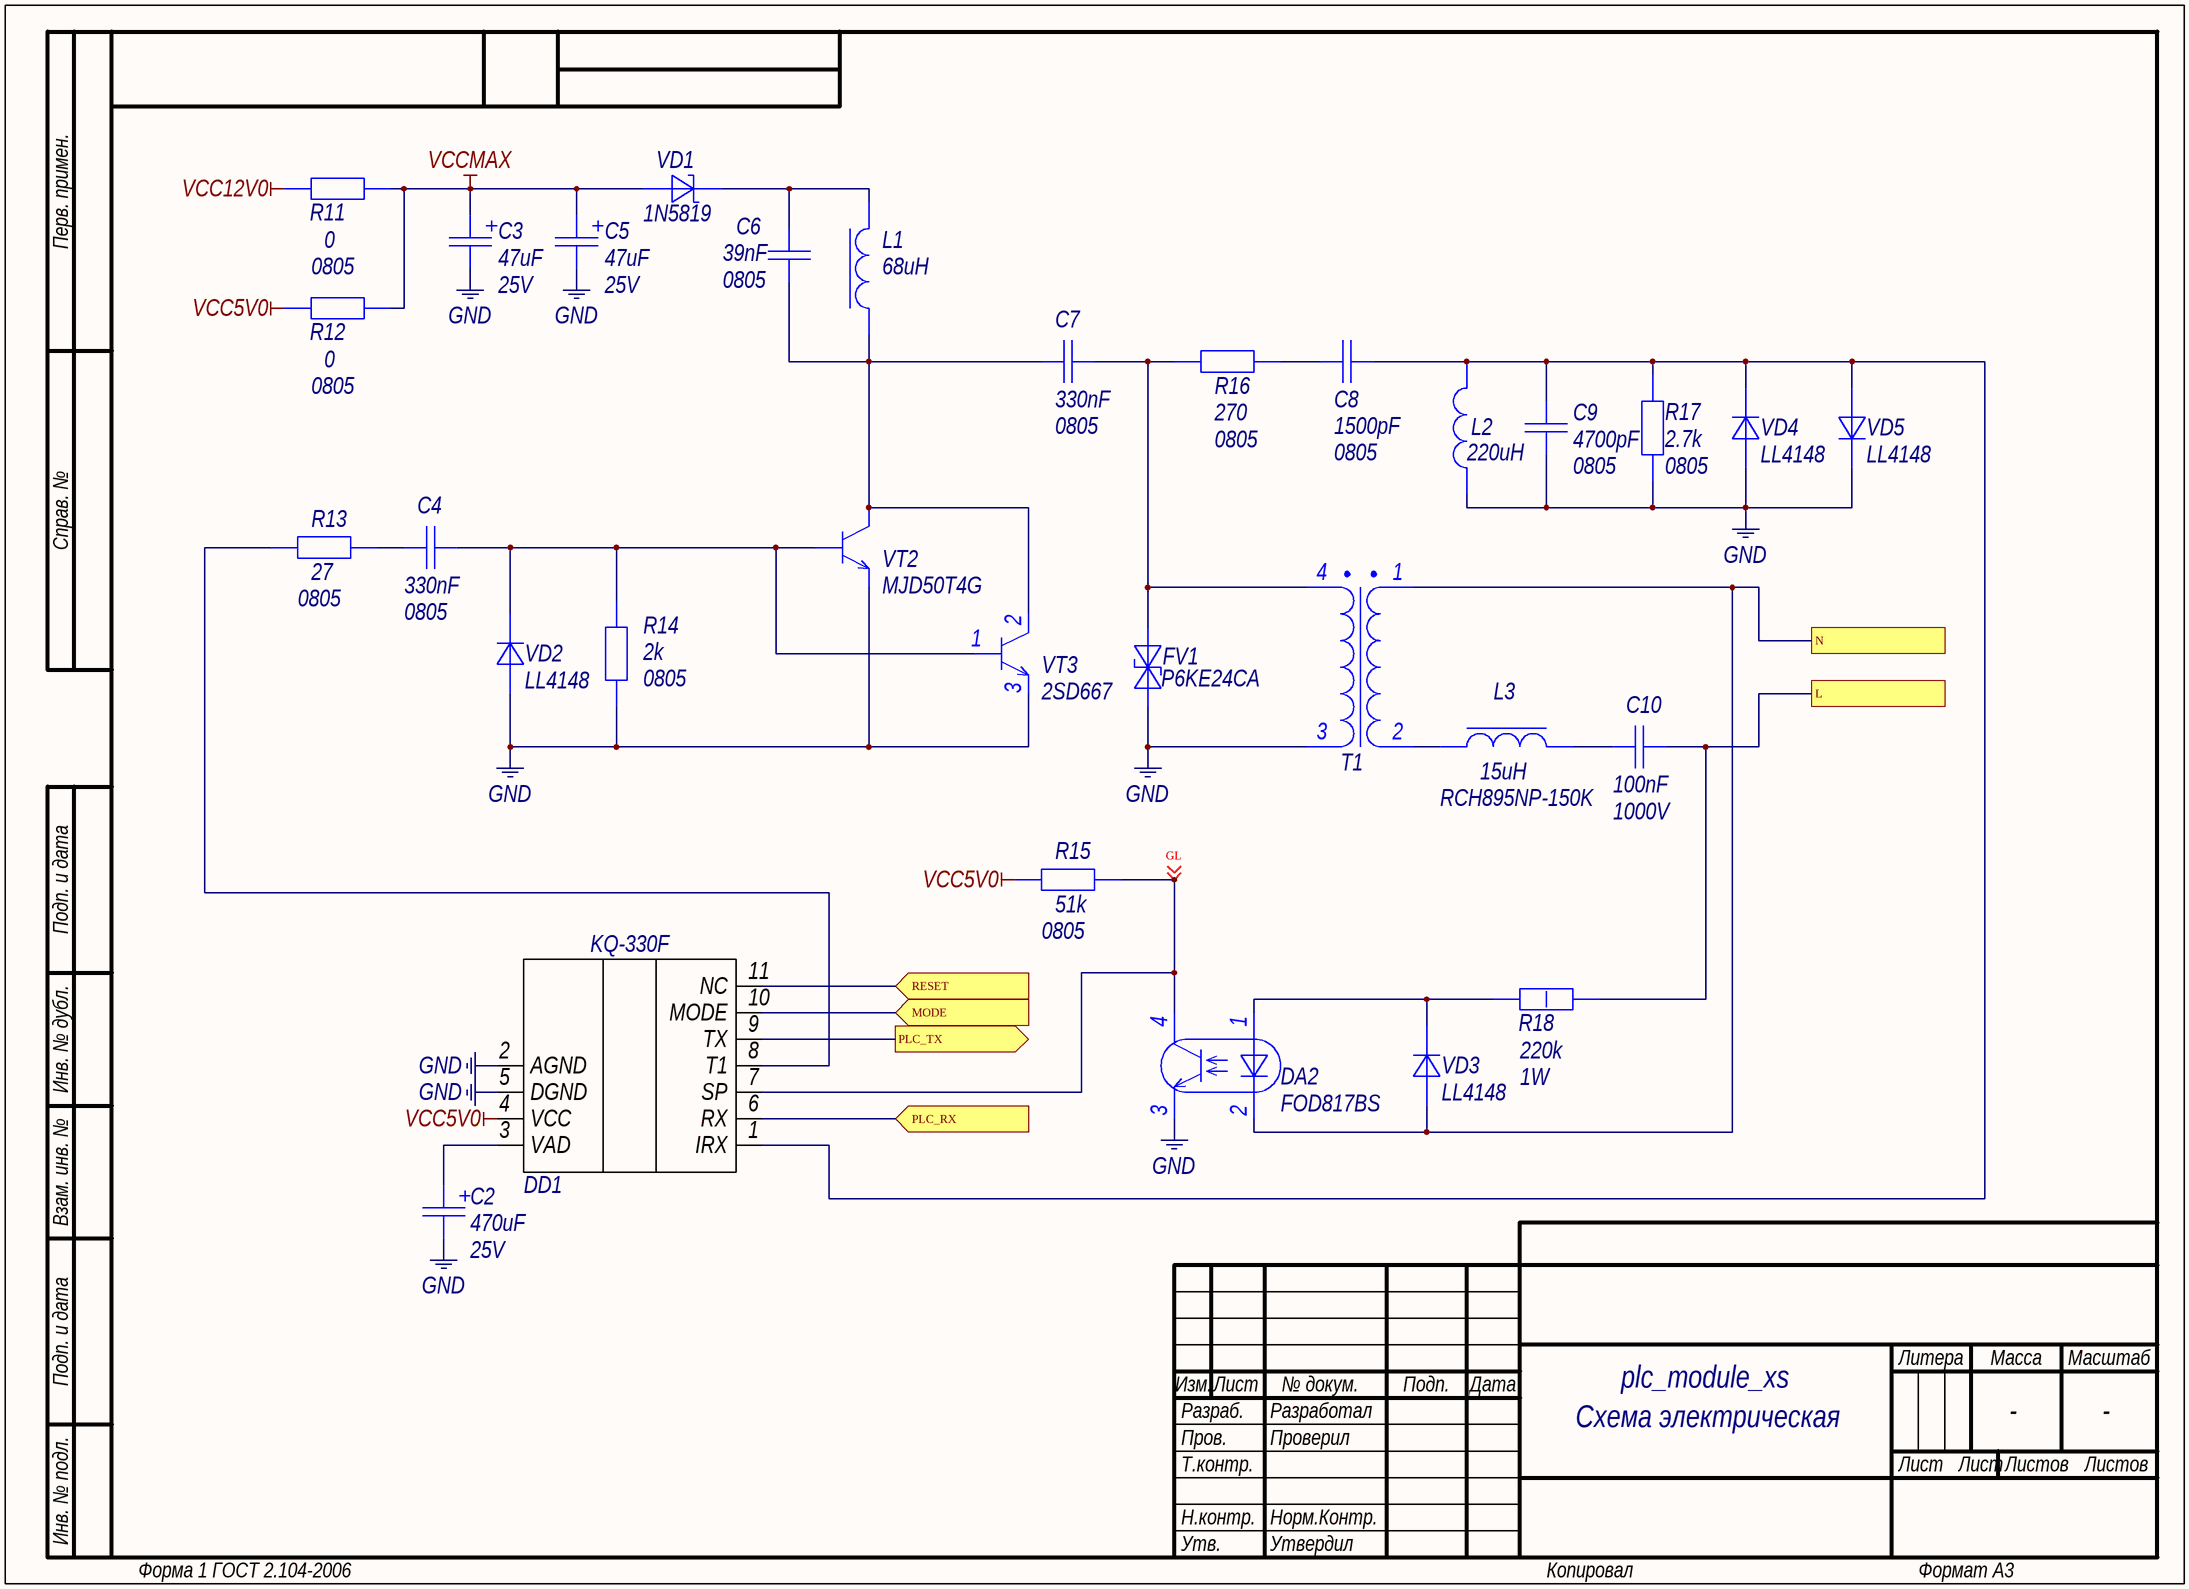
[diagram p3: plc_module_xs.00001.001_KQ330.SchDoc]

### Parts
C2  value 470uF  Voltage: 25V  [CAPAE1030X1020N]  (hidden comment: EEEFK1E471P)
C3  value 47uF  Voltage: 25V  [CAPAE660X540N]  (hidden comment: EEEFK1E470P)
C4  Footprint: 0805  [C0805]  (hidden comment: 330nF)
C5  value 47uF  Voltage: 25V  [CAPAE660X540N]  (hidden comment: EEEFK1E470P)
C6  Footprint: 0805  [C0805]  (hidden comment: 39nF)
C7  Footprint: 0805  [C0805]  (hidden comment: 330nF)
C8  Footprint: 0805  [C0805]  (hidden comment: 1500pF)
C9  Footprint: 0805  [C0805]  (hidden comment: 4700pF)
C10  value 100nF  Voltage: 1000V  [CAPR1500-800X1800X1500]  (hidden comment: B32652A104J)
DA2  FOD817BS  [SMD-4]
DD1  KQ-330F  [KQ-330F]
FV1  P6KE24CA  [DO-15]
L1  value 68uH  [RLB0914_BOURNS]  (hidden comment: RLB0914-680KL)
L2  value 220uH  [EC24]  (hidden comment: EC24-221K)
L3  value 15uH  [RLB0914_BOURNS]  (hidden comment: RCH895NP-150K)
R11  Footprint: 0805  [R0805]  (hidden comment: 0)
R12  Footprint: 0805  [R0805]  (hidden comment: 0)
R13  Footprint: 0805  [R0805]  (hidden comment: 27)
R14  Footprint: 0805  [R0805]  (hidden comment: 2k)
R15  Footprint: 0805  [R0805]  (hidden comment: 51k)
R16  Footprint: 0805  [R0805]  (hidden comment: 270)
R17  Footprint: 0805  [R0805]  (hidden comment: 2.7k)
R18  value 220k  Total Power Dissipation: 1W  [RES1651-1000X390]  (hidden comment: RSF200JB-73-220K)
T1  Coupling_Coil  [KQ330COIL]  (value not drawn)
VD1  1N5819  [DO-41]
VD2  LL4148  [SOD-80]
VD3  LL4148  [SOD-80]
VD4  LL4148  [SOD-80]
VD5  LL4148  [SOD-80]
VT2  MJD50T4G  [DIODES-INC_TO-252-3L]
VT3  Part Number: 2SD667  [TO-92-D]  (hidden comment: BJT-NPN)

### Ports
L, MODE (in), N, PLC_RX (in), PLC_TX (out), RESET (in)

### Nets
GND: C2.2 C3.2 C5.2 C9.2 DA2.3(Э) DD1.2(AGND) DD1.5(DGND) FV1.1(А) L2.1 R14.1 R17.2 T1.3 VD2.1(А) VD4.1(А) VD5.2(К) VT2.3(Э) VT3.3(Э)
VCC5V0: DD1.4(VCC) R12.1 R15.2
VCC12V0: R11.1
VCCMAX: C3.1 C5.1 R11.2 R12.2 VD1.2(А)
GL: DA2.4(К) DD1.7(SP) R15.1 ; off-sheet GL
NetC2_1: C2.1 DD1.3(VAD)
NetC4_1: C4.1 R13.2
NetC4_2: C4.2 R14.2 VD2.2(К) VT2.1(Б) VT3.1(Б)
NetC6_1: C6.1 C7.1 L1.1 VT2.2(К) VT3.2(К)
NetC6_2: C6.2 L1.2 VD1.1(К)
NetC7_2: C7.2 FV1.2(К) R16.2 T1.4
NetC8_1: C8.1 R16.1
NetC8_2: C8.2 C9.1 DD1.1(IRX) L2.2 R17.1 VD4.2(К) VD5.1(А)
NetC10_1: C10.1 L3.2
NetC10_2: C10.2 R18.2 ; port L
NetDA2_1: DA2.1(CА) R18.1 VD3.2(К)
NetDA2_2: DA2.2(CК) T1.1 VD3.1(А) ; port N
NetDD1_6: DD1.6(RX) ; port PLC_RX
NetDD1_8: DD1.8(T1) R13.1
NetDD1_9: DD1.9(TX) ; port PLC_TX
NetDD1_10: DD1.10(MODE) ; port MODE
NetDD1_11: DD1.11(NC) ; port RESET
NetL3_1: L3.1 T1.2

### Notes on the sheet
- Схема электрическая
  принципиальная
- Перв. примен.
- Справ. №
- Подп. и дата
- Инв. № дубл.
- Взам. инв. №
- Разраб.
- Изм.
- Лист
- № докум.
- Подп.
- Дата
- Литера
- Масса
- Масштаб
- Пров.
- Т.контр.
- Листов
- Инв. № подл.
- Н.контр.
- Утв.
- Форма 1 ГОСТ 2.104-2006
- Копировал
- Формат А3

### Library data of the parts
C2 = EEEFK1E471P: Type: Конденсатор; ID: 1; Tolerance: 20%; ESR: 0.08ohm; URL1: <div><a href="https://www.terraelectronica.ru/product/310291">https://www.terraelectronica.ru/product/310291</a></div>; Published: 23.04.2010; Publisher: Andrew Danich; Part Number: EEEFK1E471P; Distributor1: terraelectronica; Distributor2: chipdip; URL2: https://www.chipdip.ru/product1/8000425032
C3 C5 = EEEFK1E470P: Manufacturer: PANASONIC; Type: Конденсатор; ID: 4; Tolerance: 20%; URL1: <div><a href="https://www.terraelectronica.ru/product/577701">https://www.terraelectronica.ru/product/577701</a></div>; Published: 23.04.2010; Publisher: Andrew Danich; Part Number: EEEFK1E470P; Distributor1: terraelectronica
C4 C7 = CC0805KKX7R9BB334: Manufacturer: Yageo; Type: Конденсатор; ID: 235; Voltage: 50V; Tolerance: ±10%; Dielectric Type: X7R; Application Category: 1; Working Temperature Min: -55°С; Working Temperature Max: +125°С; URL1: <div><a href="https://www.terraelectronica.ru/product/1078481">https://www.terraelectronica.ru/product/1078481</a></div>; Published: 18.05.2010; Publisher: Andrew Danich; Part Number: CC0805KKX7R9BB334; Value: 330nF; Distributor1: Terraelectronica
C6 = CC0805KRX7R9BB393: Manufacturer: Yageo; Type: Конденсатор; ID: 234; Voltage: 50V; Tolerance: ±5%; Dielectric Type: X7R; Application Category: 1; Working Temperature Min: -55°С; Working Temperature Max: +125°С; URL1: <div><a href="https://www.terraelectronica.ru/product/1080422">https://www.terraelectronica.ru/product/1080422</a></div>; Published: 18.05.2010; Publisher: Andrew Danich; Part Number: CC0805KRX7R9BB393; Value: 39nF; Distributor1: Terraelectronica
C8 = CC0805JRNPO9BN152: Manufacturer: Yageo; Type: Конденсатор; ID: 236; Voltage: 50V; Tolerance: ±5%; Dielectric Type: NP0; Application Category: 1; Working Temperature Min: -55°С; Working Temperature Max: +125°С; Published: 18.05.2010; Publisher: Andrew Danich; Part Number: CC0805JRNPO9BN152; Value: 1500pF; Distributor1: Terraelectronica
C9 = CC0805JKNPO9BN472: Manufacturer: Murata; Type: Конденсатор; ID: 233; Voltage: 50V; Tolerance: ±5%; Dielectric Type: NP0; Application Category: 1; Working Temperature Min: -55°С; Working Temperature Max: +125°С; Published: 18.05.2010; Publisher: Andrew Danich; Part Number: CC0805JKNPO9BN472; Value: 4700pF
C10 = B32652A104J: Manufacturer: EPCOS AG; Type: Конденсатор; ID: 1; Tolerance: 5%; Functional Analog: К73-17 имп, 0.1 мкФ, 1000 В, 5%  B32652A0104J; URL1: <div><a href="https://www.terraelectronica.ru/product/608082">https://www.terraelectronica.ru/product/608082</a></div>; Published: 18.05.2010; Publisher: Andrew Danich; Part Number: B32652A104J; Distributor1: terraelectronica; Distributor2: chipdip; URL2: https://www.chipdip.ru/product/b32652a0104j000
DA2 = FOD817BS: ID: 15; Input Voltage: 1.2V; Input Current: 20mA; Output Voltage: 35V; Output Current: 50mA; Total Power Dissipation: 150mW; Current Transfer Ratio: 50…600%; Cut-off Frequency: 80kHz; Application Category: 1; Published: 09.01.2017; Publisher: Andrew Danich; Type: Микросхема; Part Number: FOD817BS; Value: FOD817BS
DD1 = KQ-330F: Manufacturer: kq100.com; ID: 1; Data Rate: 1200bps; Input Speed: 9600baud; Application Type: Transceiver; Input Interface: UART; Published: 18.08.2014; Publisher: Andrew Danich; Type: Микросхема; Part Number: KQ-330F; Value: KQ-330F; Functional Analog: -; Distributor1: Alibaba; Distributor2: Taobao
FV1 = P6KE24CA: Suppressor-Bi; ID: 1; Reverse Voltage: 20.5V; Reverse Current: 100A; Total Power Dissipation: 0; Published: 27.07.2015; Publisher: Andrew Danich; Type: Супрессор; Part Number: P6KE24CA; Value: P6KE24CA
L1 = RLB0914-680KL: Type: Дроссель; ID: 9; Rated Current: 1200mA; Tolerance: 10%; Q: 30; DC Resistance: 0.2Ohm; Self-Resonant Frequency: 4.5MHz; Published: 20.05.2010; Publisher: Andrew Danich; Part Number: RLB0914-680KL
L2 = EC24-221K: Type: Дроссель; ID: 8; Rated Current: 130mA; Tolerance: 10%; Q: 60; DC Resistance: 5.7Ohm; Self-Resonant Frequency: 4MHz; URL1: <div><a href="https://www.chipdip.ru/product/ec24-221k">https://www.chipdip.ru/product/ec24-221k</a></div>; Published: 20.05.2010; Publisher: Andrew Danich; Part Number: EC24-221K; Distributor1: ChipDip
L3 = RCH895NP-150K: Type: Дроссель; ID: 11; Rated Current: 1.8A; Tolerance: 10%; DC Resistance: 0.05Ohm; Published: 20.05.2010; Publisher: Andrew Danich; Part Number: RCH895NP-150K; Distributor2: terraelectronica; URL2: https://www.terraelectronica.ru/product/213295
R11 R12 = RC0805JR-070RL: as R1 on sheet plc_module_xs.00001.001_DALI_Master; Published: 24.03.2010; Publisher: Andrew Danich; Type: Резистор; Part Number: RC0805JR-070RL; Value: 0
R13 = RC0805JR-0727RL: Manufacturer: Yageo; ID: 125; Limit Voltage: 150V; Tolerance: ±5%; Temperature Coefficient: 100ppm; Total Power Dissipation: 0.125W; Series Type: Thick-Film; Application Category: 1; Working Temperature Min: -55°С; Working Temperature Max: +155°С; Published: 24.03.2010; Publisher: Andrew Danich; Type: Резистор; Part Number: RC0805JR-0727RL; Value: 27
R14 = RC0805JR-072KL: Manufacturer: Yageo; ID: 129; Limit Voltage: 150V; Tolerance: ±5%; Temperature Coefficient: 100ppm; Total Power Dissipation: 0.125W; Series Type: Thick-Film; Application Category: 1; Working Temperature Min: -55°С; Working Temperature Max: +155°С; Published: 24.03.2010; Publisher: Andrew Danich; Type: Резистор; Part Number: RC0805JR-072KL; Value: 2k
R15 = RC0805JR-0751KL: Manufacturer: Yageo; ID: 154; Limit Voltage: 150V; Tolerance: ±5%; Temperature Coefficient: 100ppm; Total Power Dissipation: 0.125W; Series Type: Thick-Film; Application Category: 1; Working Temperature Min: -55°С; Working Temperature Max: +155°С; Published: 24.03.2010; Publisher: Andrew Danich; Type: Резистор; Part Number: RC0805JR-0751KL; Value: 51k
R16 = RC0805JR-07270RL: Manufacturer: Yageo; ID: 446; Limit Voltage: 150V; Tolerance: ±5%; Temperature Coefficient: 100ppm; Total Power Dissipation: 0.125W; Series Type: Thick-Film; Application Category: 1; Working Temperature Min: -55°С; Working Temperature Max: +155°С; Published: 24.03.2010; Publisher: Andrew Danich; Type: Резистор; Part Number: RC0805JR-07270RL; Value: 270
R17 = RC0805JR-072K7L: Manufacturer: Yageo; ID: 442; Limit Voltage: 150V; Tolerance: ±5%; Temperature Coefficient: 100ppm; Total Power Dissipation: 0.125W; Series Type: Thick-Film; Application Category: 1; Working Temperature Min: -55°С; Working Temperature Max: +155°С; URL1: <div><a href="https://www.terraelectronica.ru/product/558399">https://www.terraelectronica.ru/product/558399</a></div>; Published: 24.03.2010; Publisher: Andrew Danich; Type: Резистор; Part Number: RC0805JR-072K7L; Value: 2.7k; Distributor1: Terraelectronica; Distributor2: ChipDip; URL2: https://www.chipdip.ru/product0/8715864745
R18 = RSF200JB-73-220K: ID: 3; Limit Voltage: 500V; Tolerance: 5%; Series Type: CF-100; Published: 19.09.2014; Publisher: Andrew Danich; Type: Резистор; Part Number: RSF200JB-73-220K; Distributor1: chipdip
T1 = KQ330_Coupling_Coil: Power Line Communication Coupling Transformer; Type: Трансформатор; Published: 06.04.2010; Publisher: Viktor Klishin
VD1 = 1N5819: Manufacturer: ST Microelectronics; Type: Диод; ID: 1; Reverse Voltage: 50V; Reverse Current: 0.5mA; Forward Voltage: 0.55V; Forward Current: 1A; URL1: <div><a href="https://www.terraelectronica.ru/product/343651">https://www.terraelectronica.ru/product/343651</a></div>; Published: 18.05.2010; Publisher: Andrew Danich; Part Number: 1N5819; Value: 1N5819; Application Category: 1; Distributor1: terraelectronica; Distributor2: chipdip; URL2: https://www.chipdip.ru/product/1n5819-2
VD2-VD5 = LL4148: Type: Диод; ID: 1; Reverse Voltage: 100V; Reverse Current: 3uA; Forward Voltage: 1V; Forward Current: 200mA; Total Power Dissipation: 0.5W; Capacitance: 4pF; Recovery Time: 4nS; Published: 18.05.2010; Publisher: Andrew Danich; Part Number: LL4148; Value: LL4148
VT2 = MJD50T4G: BJT-NPN; Type: Транзистор; ID: 19; C-E Voltage: 40V; Collector Current: 1A; C-E Saturation Voltage: 1.0V; DC Current Gain: 10…150; Total Power Dissipation: 1.56W; Transition Frequency: 10MHz; URL1: <div><a href="https://www.terraelectronica.ru/product/259312">https://www.terraelectronica.ru/product/259312</a></div>; Published: 07.05.2013; Publisher: Andrew Danich; Part Number: MJD50T4G; Value: MJD50T4G; Distributor1: Terraelectronica; Distributor2: ChipDip; URL2: https://www.chipdip.ru/product1/8861890713
VT3 = 2SD667: Manufacturer: HITACHI; Type: Транзистор; ID: 1; Value: 2SD667; C-E Voltage: 80V; Collector Current: 1A; C-E Saturation Voltage: 1V; DC Current Gain: 30…320; Total Power Dissipation: 900mW; Transition Frequency: 140MHz; Working Temperature Min: -55°С; Working Temperature Max: +150°С; Published: 07.05.2013; Publisher: Andrew Danich

## Sheet plc_module_xs.00001.001_Power.SchDoc: =GlobalProjectName
size 410 x 297 mm; ApprovedBy: Утвердил; CheckedBy: Проверил; Author: Разработал; Organization: TheGreenLight; DocumentNumber: 000001.001 Э3; Revision: 1.0; SheetNumber: Лист; SheetTotal: Листов; PageSetup: Record=PageOptions|CenterHorizontal=True|CenterVertical=True|PrintScale=1.00|XCorrection=1.00|YCorrection=1.00|PrintKind=1|BorderSize=5000000|LeftOffset=0|BottomOffset=0|Orientation=2|PaperLength=1000|PaperWidth=1000|Scale=100|PaperSource=15|PrintQuality=1200|MediaType=1|DitherType=10|PaperKind=A3|PrintScaleMode=1; Weight: -; ScaleFactor: -; NormInspection: Норм.Контр.; FirstApplication: 000001.001; DocumentName: plc_module_xs
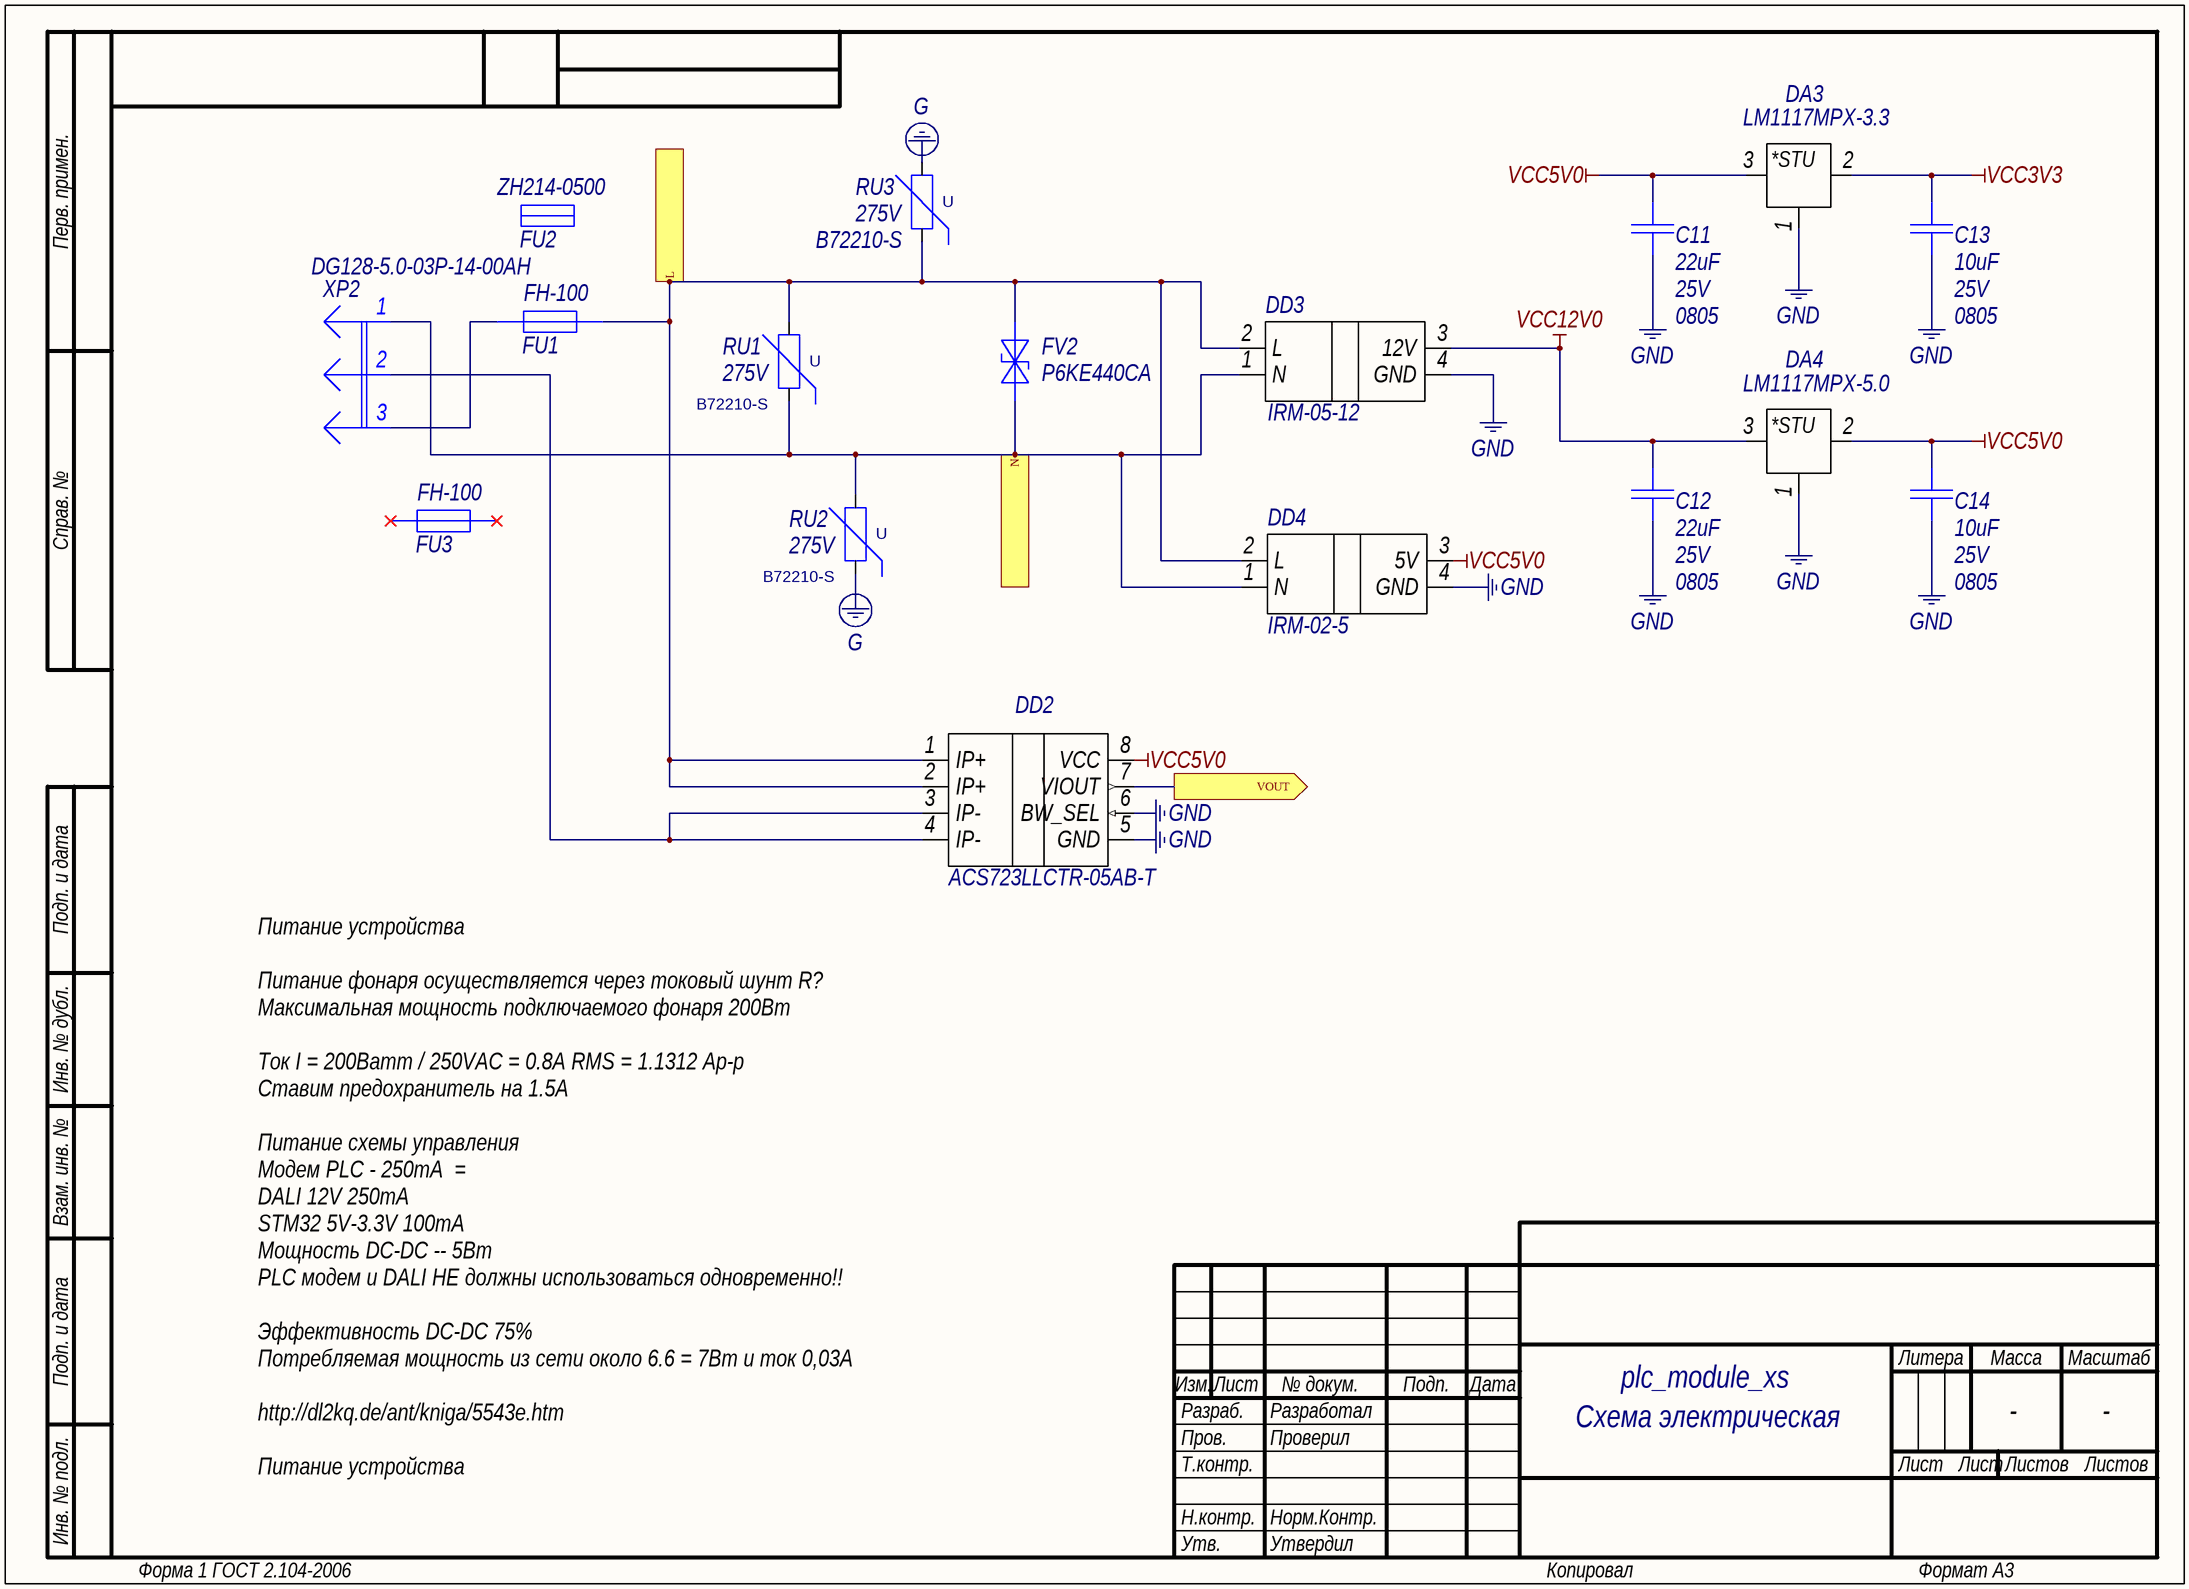
[diagram p4: plc_module_xs.00001.001_Power.SchDoc]

### Parts
C11  Voltage: 25V  Footprint: 0805  [C0805]  (hidden comment: 22uF)
C12  Voltage: 25V  Footprint: 0805  [C0805]  (hidden comment: 22uF)
C13  Voltage: 25V  Footprint: 0805  [C0805]  (hidden comment: 10uF)
C14  Voltage: 25V  Footprint: 0805  [C0805]  (hidden comment: 10uF)
DA3  value LM1117MPX-3.3  [SOT-223]  (hidden comment: LM1117-Series)
DA4  value LM1117MPX-5.0  [SOT-223]  (hidden comment: LM1117-Series)
DD2  ACS723LLCTR-05AB-T  [SOIC-8]
DD3  IRM-05-12  [IRM-05-12]
DD4  IRM-02-5  [IRM-02-5]
FU1  value FH-100  [F-W20.0/E5.0]  (hidden comment: Fuse)
FU2  ZH214-0500  [FUSE_SCHURTER_FSF5X20]  (mechanical)
FU3  value FH-100  [F-W20.0/E5.0]  (hidden comment: Fuse)  (mechanical)
FV2  P6KE440CA  [DO-15]
RU1  B72210-S  Max Continuous voltage (RMS): 275V  [VAR_EPCOS_B72210S0461K101]
RU2  B72210-S  Max Continuous voltage (RMS): 275V  [VAR_EPCOS_B72210S0461K101]
RU3  B72210-S  Max Continuous voltage (RMS): 275V  [VAR_EPCOS_B72210S0461K101]
XP2  value DG128-5.0-03P-14-00AH  [PHOENIX_1715734]  (hidden comment: LIN LOUT N)

### Ports
L, N, VOUT (out)

### Nets
G: RU2.2 RU3.1
GND: C11.1 C12.1 C13.1 C14.1 DA3.1(Adj/GND) DA4.1(Adj/GND) DD2.5(GND) DD2.6(BW_SEL) DD3.4(GND) DD4.4(GND)
VCC3V3: C13.2 DA3.2(Out)
VCC5V0: C11.2 C14.2 DA3.3(In) DA4.2(Out) DD2.8(VCC) DD4.3(5V)
VCC12V0: C12.2 DA4.3(In) DD3.3(12V)
NetC10_2: DD2.1(IP+) DD2.2(IP+) DD3.2(L) DD4.2(L) FU1.2 FV2.2(К) RU1.1 RU3.2 ; port L
NetDA2_2: DD3.1(N) DD4.1(N) FV2.1(А) RU1.2 RU2.1 XP2.1 ; port N
NetDD2_3: DD2.3(IP-) DD2.4(IP-) XP2.2
NetDD2_7: DD2.7(VIOUT) ; port VOUT
NetFU1_1: FU1.1 XP2.3

Not connected (* = marked no-connect by the designer): FU3 1* 2*

### Notes on the sheet
- Схема электрическая
  принципиальная
- Питание устройства
  Питание фонаря осуществляется через токовый шунт R?
  Максимальная мощность подключаемого фонаря 200Вт
  Ток I = 200Ватт / 250VAC = 0.8A RMS = 1.1312 Аp-p
  Ставим предохранитель на 1.5A
  Питание схемы управления
  Модем PLC - 250mA  =
  DALI 12V 250mA
  STM32 5V-3.3V 100mA
  Мощность DC-DC -- 5Вт
  PLC модем и DALI НЕ должны использоваться одновременно!!
  Эффективность DC-DC 75%
  Потребляемая мощность из сети около 6.6 = 7Вт и ток 0,03А
  http://dl2kq.de/ant/kniga/5543e.htm
  Питание устройства
  Питание фонаря осуществляется через токовый шунт R?
  Максимальная мощность подключаемого фонаря 200Вт
  Ток I = 200Ватт / 250VAC = 0.8A RMS = 1.1312 Аp-p
  Ставим предохранитель на 1.5A
  Максимальный ток через шунт пусть будет 3А
  Ток насыщения датчика тока 1.2А
  MAX4372F — 50V/V
  т.е. при питании от 5В напряжение насыщения на шунте будет
  50 * Uшунт  = 5В
  Uшунт = 1/10 В = 100мВ
  Сопротивление шунта 0.1 / 1.2 = 0.083 Ом
  При токе в 3А мощность шунта 0,083 * 3 * 3 = 0,747Вт
  В наличии есть шунт 100мОм, 1Вт
  При токе в 1.2А напряжение на резисторе будет 0,1 * 1,2 = 0,12В
  На выходе услилтеля будет 6В -- насыщение
  Максимальный ток до насыщения - 1А
- Перв. примен.
- Справ. №
- Подп. и дата
- Инв. № дубл.
- Взам. инв. №
- Разраб.
- Изм.
- Лист
- № докум.
- Подп.
- Дата
- Литера
- Масса
- Масштаб
- Пров.
- Т.контр.
- Листов
- Инв. № подл.
- Н.контр.
- Утв.
- Форма 1 ГОСТ 2.104-2006
- Копировал
- Формат А3
- (in symbol B72210-S 271-K101) U
- (in symbol LM1117MPX-3.3) *STU
- (in symbol LM1117MPX-5.0) *STU

### Library data of the parts
C11 C12 = GRM21BR61E226ME44L: Manufacturer: Murata; Type: Конденсатор; ID: 39; Tolerance: ±20%; Dielectric Type: X5R; Published: 18.05.2010; Publisher: Andrew Danich; Part Number: GRM21BR61E226ME44L; Value: 22uF
C13 C14 = GRM21BR61E106KA73L: Manufacturer: Murata; Type: Конденсатор; ID: 53; Tolerance: ±10%; Dielectric Type: X5R; Published: 18.05.2010; Publisher: Andrew Danich; Part Number: GRM21BR61E106KA73L; Value: 10uF
DA3 = LM1117MPX-3.3: ID: 9; Input Voltage: +8.5…20V; Output Current: 800mA; Output Voltage: +3.3V; Published: 13.08.2015; Publisher: Andrew Danich; Type: Микросхема; Part Number: LM1117MPX-3.3
DA4 = LM1117MPX-5.0: ID: 16; Input Voltage: +8.5…20V; Output Current: 800mA; Output Voltage: +3.3V; URL1: <div><a href="https://www.terraelectronica.ru/product/133540">https://www.terraelectronica.ru/product/133540</a></div>; Published: 13.08.2015; Publisher: Andrew Danich; Type: Микросхема; Part Number: LM1117MPX-5.0; Distributor1: terraelectronica; Distributor2: chipdip; URL2: https://www.chipdip.ru/product/lm1117mpx-5.0-nopb
DD2 = ACS723LLCTR-05AB-T: ID: 6; Published: 13.08.2015; Publisher: Andrew Danich; Type: Микросхема; Part Number: ACS723LLCTR-05AB-T
DD3 = IRM-05-12: Manufacturer: Mean Well (MW); ID: 2; Input Voltage: +12V; Output Current: 420mA; Power: 5W; Working Temperature Min: -30C; Working Temperature Max: +70C; URL1: <div><a href="https://www.terraelectronica.ru/product/1202359">https://www.terraelectronica.ru/product/1202359</a></div>; Part Number: IRM-05-12; Value: IRM-05-12; Output Voltage: +12V; Distributor1: Terraelectronica
DD4 = IRM-02-5: Manufacturer: Mean Well (MW); ID: 17; Output Current: 400mA; Output Voltage: +5V; Power: 2W; Voltage Tolerance: ±2,5%; Working Temperature Min: -30C; Working Temperature Max: +70C; URL1: <div><a href="https://www.terraelectronica.ru/product/2118699">https://www.terraelectronica.ru/product/2118699</a></div>; Part Number: IRM-02-5; Value: IRM-02-5; Distributor1: Terraelectronica
FU1 FU3 = FH-100: ID: 17; Published: 24.09.2010; Publisher: Andrew Danich; Type: Вставка плавкая; Part Number: FH-100; Footprint: 20x5mm
FU2 = ZH214-0500: Manufacturer: Zhenhui; ID: 16; Limit Voltage: 250V; Rated Current: 0.5A; Published: 24.09.2010; Publisher: Andrew Danich; Value: ZH214-0500; Type: Вставка плавкая; Part Number: ZH214-0500; Footprint: 20x5mm
FV2 = P6KE440CA: ID: 16; Reverse Voltage: 376V; Reverse Current: 100A; Total Power Dissipation: 600W; Published: 27.07.2015; Publisher: Andrew Danich; Type: Супрессор; Part Number: P6KE440CA; Value: P6KE440CA; Distributor1: Terraelectronica; Distributor2: ChipDip; Distributor3: Compel
RU1-RU3 = B72210-S 271-K101: ID: 4; Value: S10K275; Varistor voltage at 1mA: 430V; Absorption energy: 43J; Max non-repetitve surge current: 2500A; URL1: <div><a href="https://www.chipdip.ru/product/b72210-s271-k101">https://www.chipdip.ru/product/b72210-s271-k101</a></div>; Part Number: B72210-S 271-K101; Distributor1: chipdip; Distributor2: terraelectronica
XP2 = DG128-5.0-03P-14-00AH: ID: 96; Limit Voltage: 300V; Limit Current: 10A; Connector Type: Female; Resistance: 20mohm; Pitch: 5mm; Working Temperature Min: -40°С; Working Temperature Max: +105°С; Published: 07.03.2013; Publisher: Andrew Danich; Type: Вилка; Part Number: DG128-5.0-03P-14-00AH; Pins: 2

## Nets that join several sheets
GND: plc_module_xs.00001.001_STM32 (17 pins), plc_module_xs.00001.001_DALI_Master (6 pins), plc_module_xs.00001.001_KQ330 (17 pins), plc_module_xs.00001.001_Power (10 pins)
VCC3V3: plc_module_xs.00001.001_STM32 (9 pins), plc_module_xs.00001.001_Power (C13.2 DA3.2)
VCC5V0: plc_module_xs.00001.001_STM32 (DD7.11 DD7.20), plc_module_xs.00001.001_KQ330 (DD1.4 R12.1 R15.2), plc_module_xs.00001.001_Power (6 pins)
VCC12V0: plc_module_xs.00001.001_KQ330 (R11.1), plc_module_xs.00001.001_Power (C12.2 DA4.3 DD3.3)
VCCMAX: plc_module_xs.00001.001_DALI_Master (DA1.8), plc_module_xs.00001.001_KQ330 (5 pins)
NetC10_2: plc_module_xs.00001.001_KQ330 (C10.2 R18.2), plc_module_xs.00001.001_Power (8 pins)
NetDA1_7: plc_module_xs.00001.001_STM32 (DD8.6), plc_module_xs.00001.001_DALI_Master (DA1.7 R6.1)
NetDA2_2: plc_module_xs.00001.001_KQ330 (DA2.2 T1.1 VD3.1), plc_module_xs.00001.001_Power (6 pins)
NetDD1_6: plc_module_xs.00001.001_STM32 (DD7.15), plc_module_xs.00001.001_KQ330 (DD1.6)
NetDD1_9: plc_module_xs.00001.001_STM32 (DD7.13), plc_module_xs.00001.001_KQ330 (DD1.9)
NetDD1_10: plc_module_xs.00001.001_STM32 (DD7.17), plc_module_xs.00001.001_KQ330 (DD1.10)
NetDD1_11: plc_module_xs.00001.001_STM32 (DD7.19), plc_module_xs.00001.001_KQ330 (DD1.11)
NetDD2_7: plc_module_xs.00001.001_STM32 (R19.2), plc_module_xs.00001.001_Power (DD2.7)
NetDD8_9: plc_module_xs.00001.001_STM32 (DD8.9), plc_module_xs.00001.001_DALI_Master (R1.1 R2.2)
NetDD8_14: plc_module_xs.00001.001_STM32 (DD8.14 R23.1), plc_module_xs.00001.001_DALI_Master (R1.2 R3.1)

## Assembly variants
Rev1.2_Very_simple_KCHR_ALIBERD: not fitted C12 C14 DA4 DD2 DD3 DD5 HL2 R1 R7 R11 R23 VT2 XP3